# Altium schematic sheet RF-BIG-DB5AT_main_v1.schdoc
size OrCAD D; Organization: MAHLE International GmbH; Address1: Pragstr. 26 - 46; Address2: 70376 Stuttgart; Address3: Germany; DocumentNumber: 1; SheetNumber: 1; SheetTotal: 3
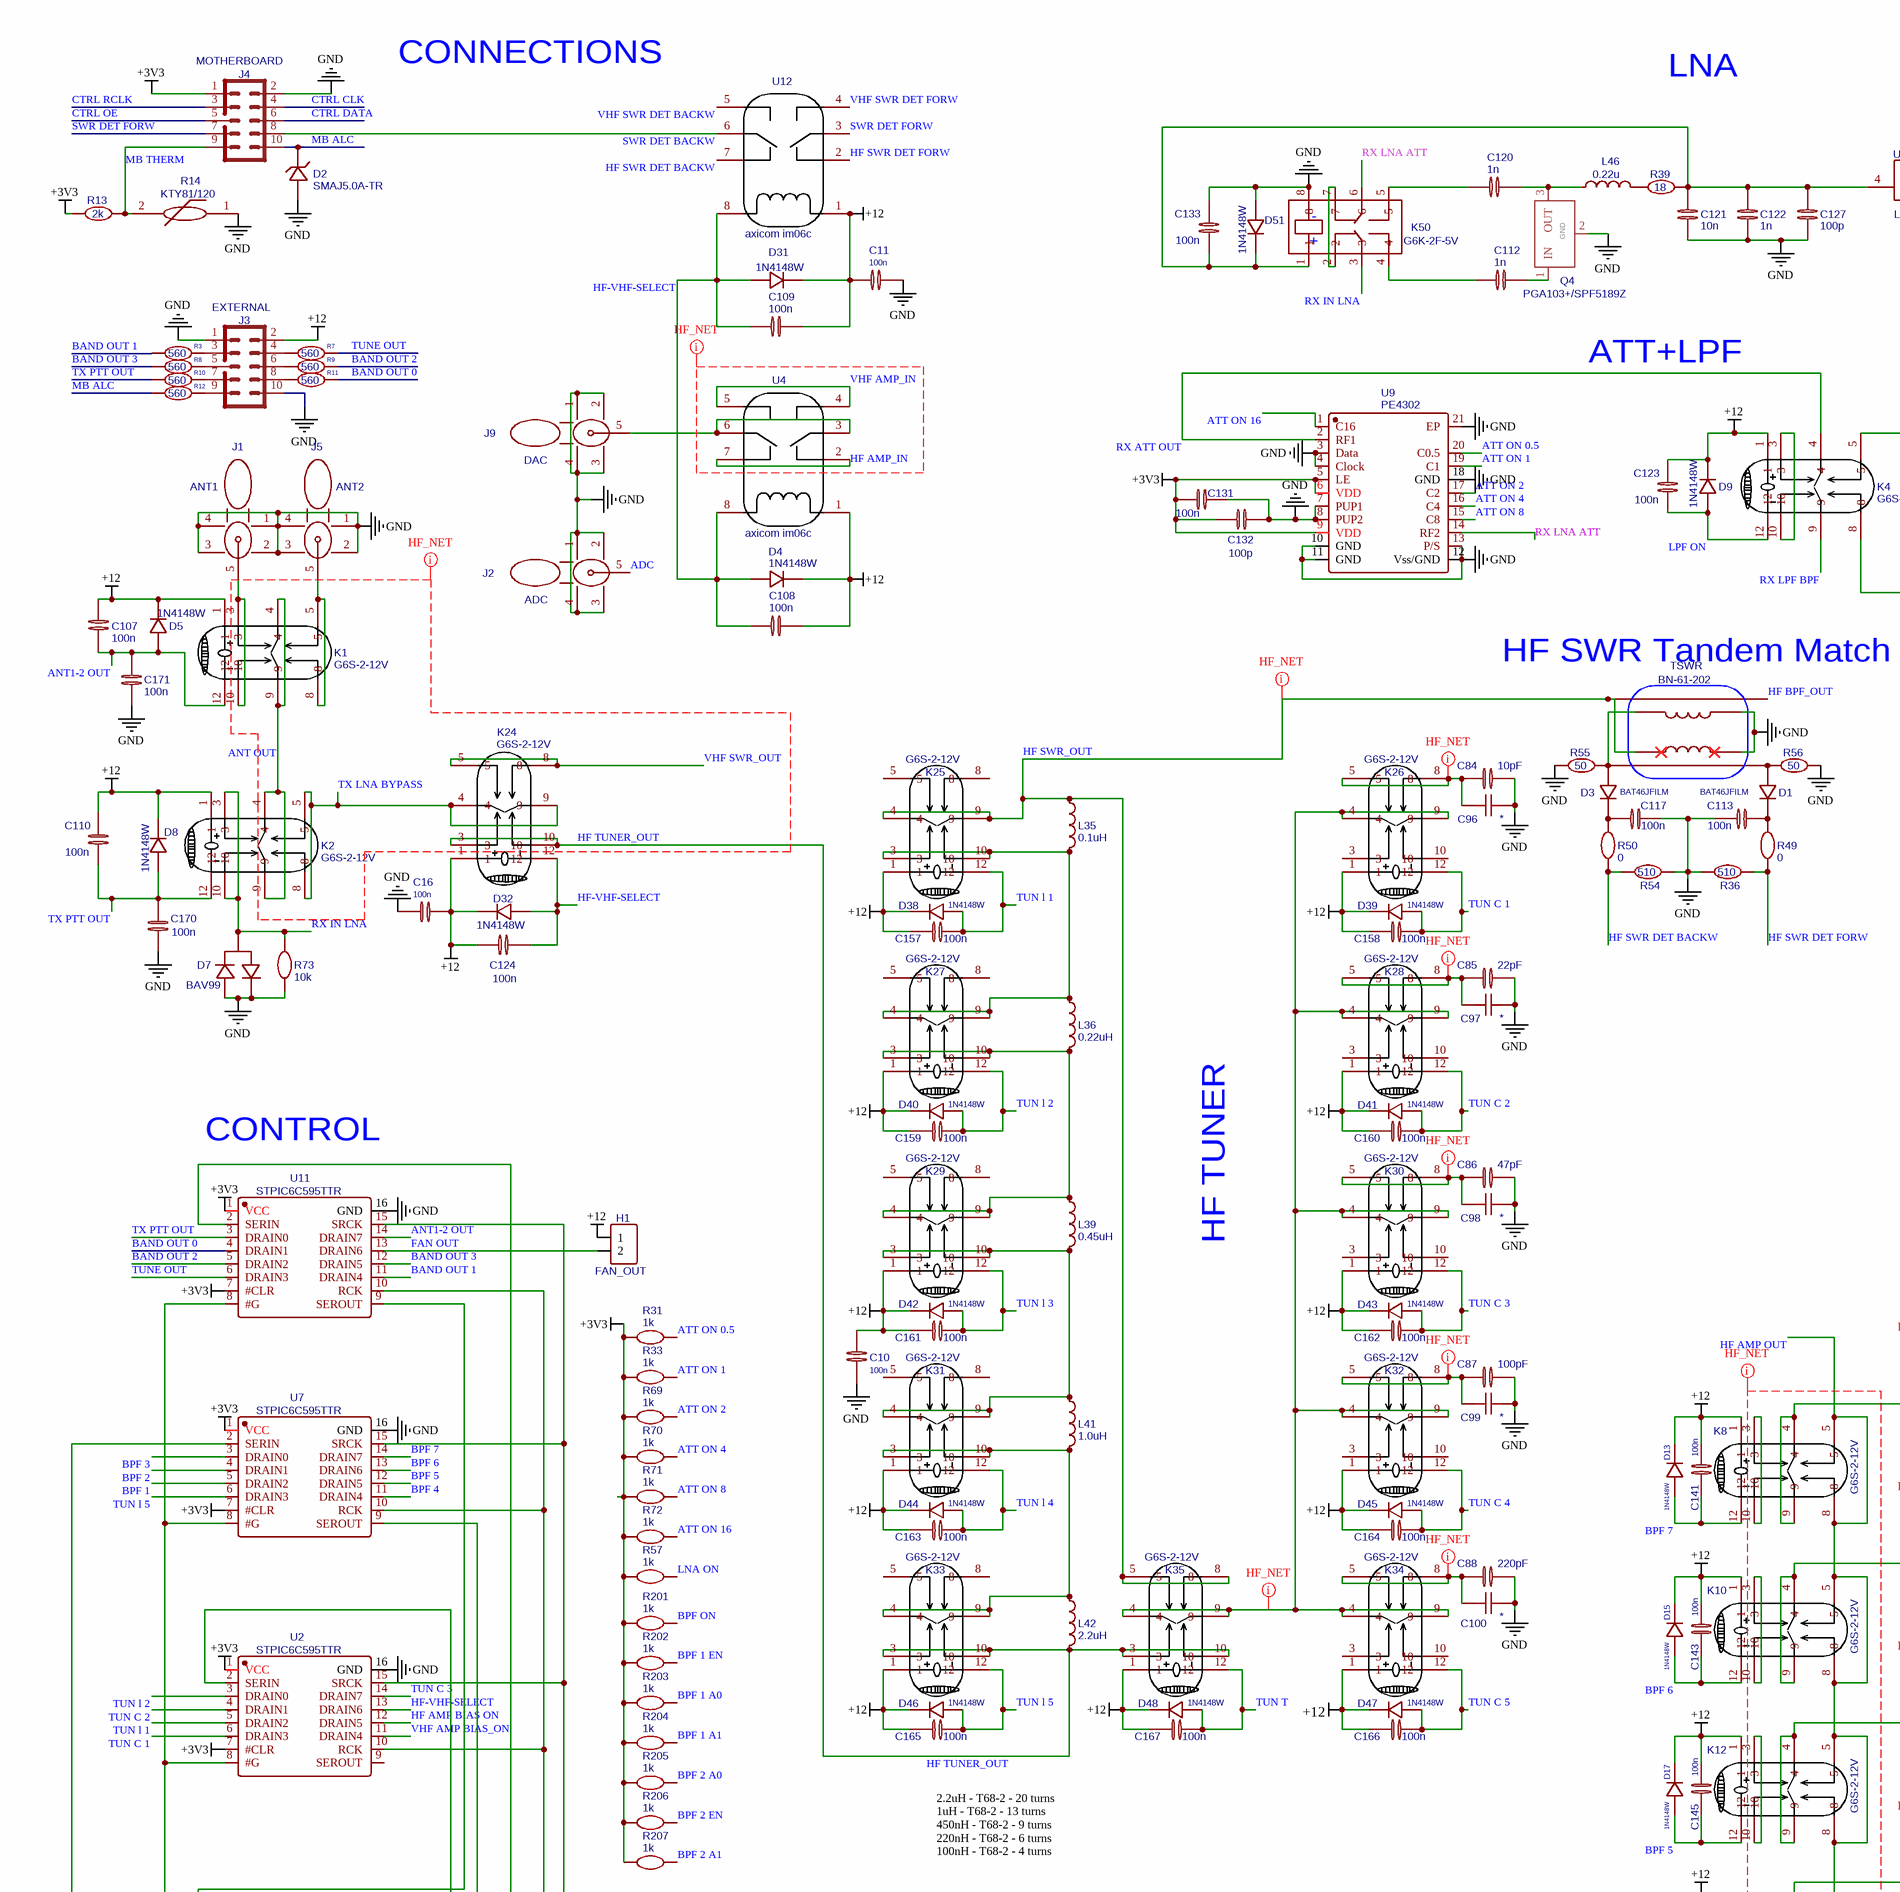
[diagram p0: RF-BIG-DB5AT_main_v1.schdoc, top left]
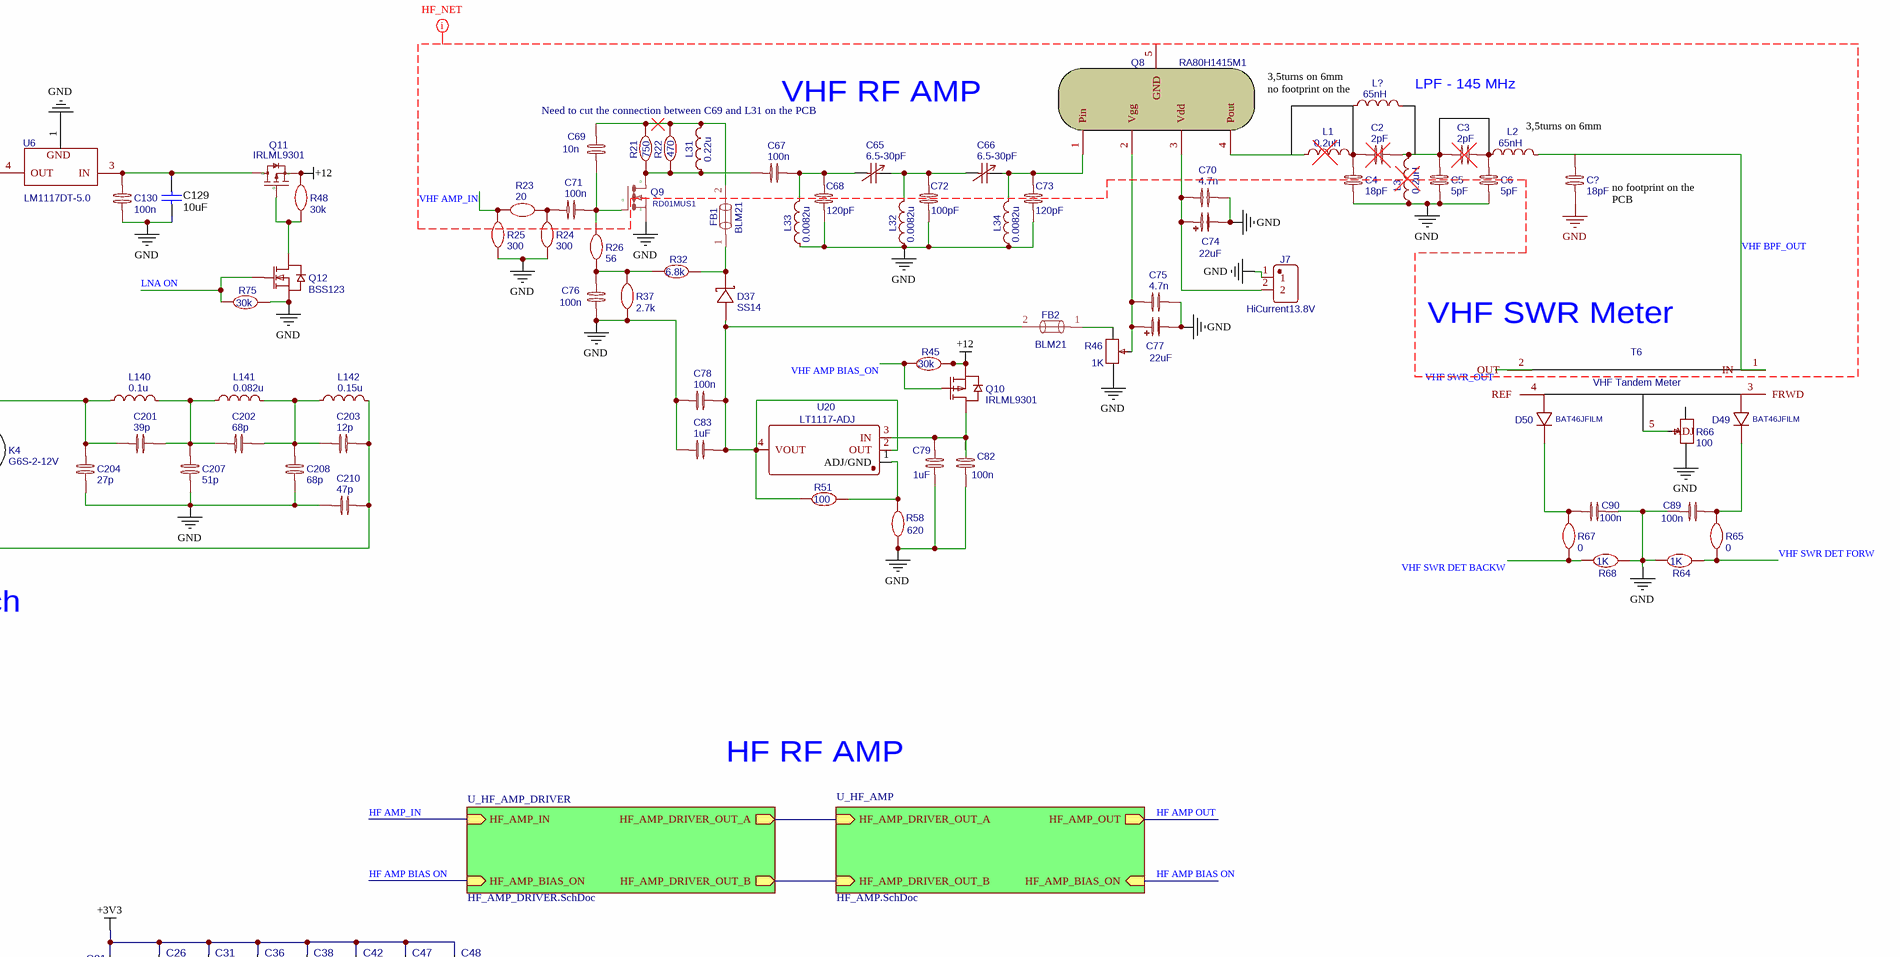
[diagram p1: RF-BIG-DB5AT_main_v1.schdoc, top right]
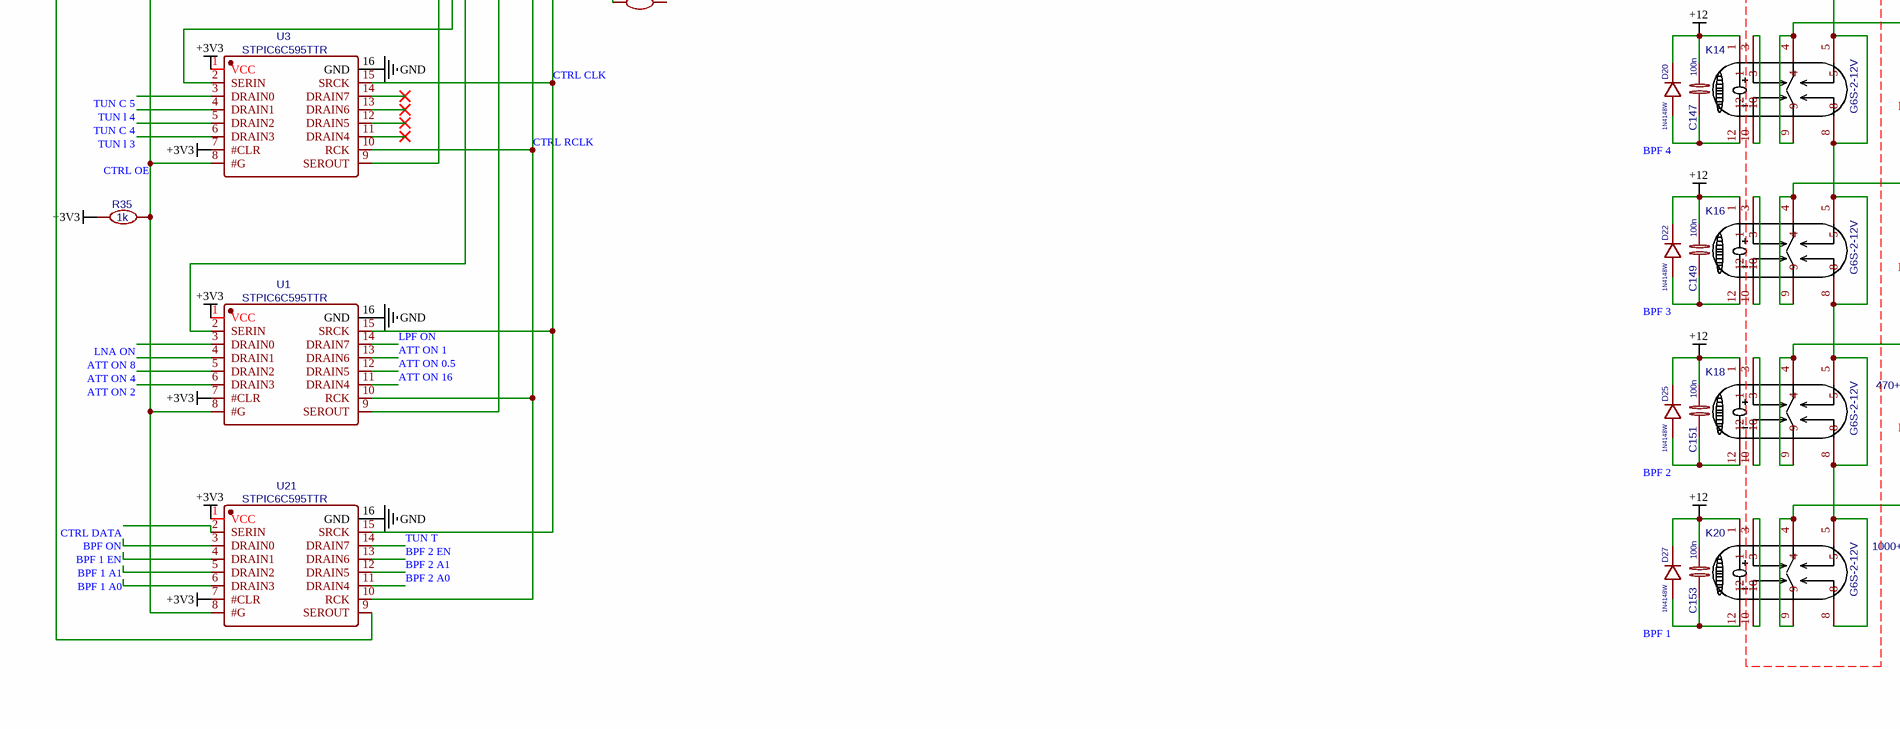
[diagram p2: RF-BIG-DB5AT_main_v1.schdoc, bottom left]
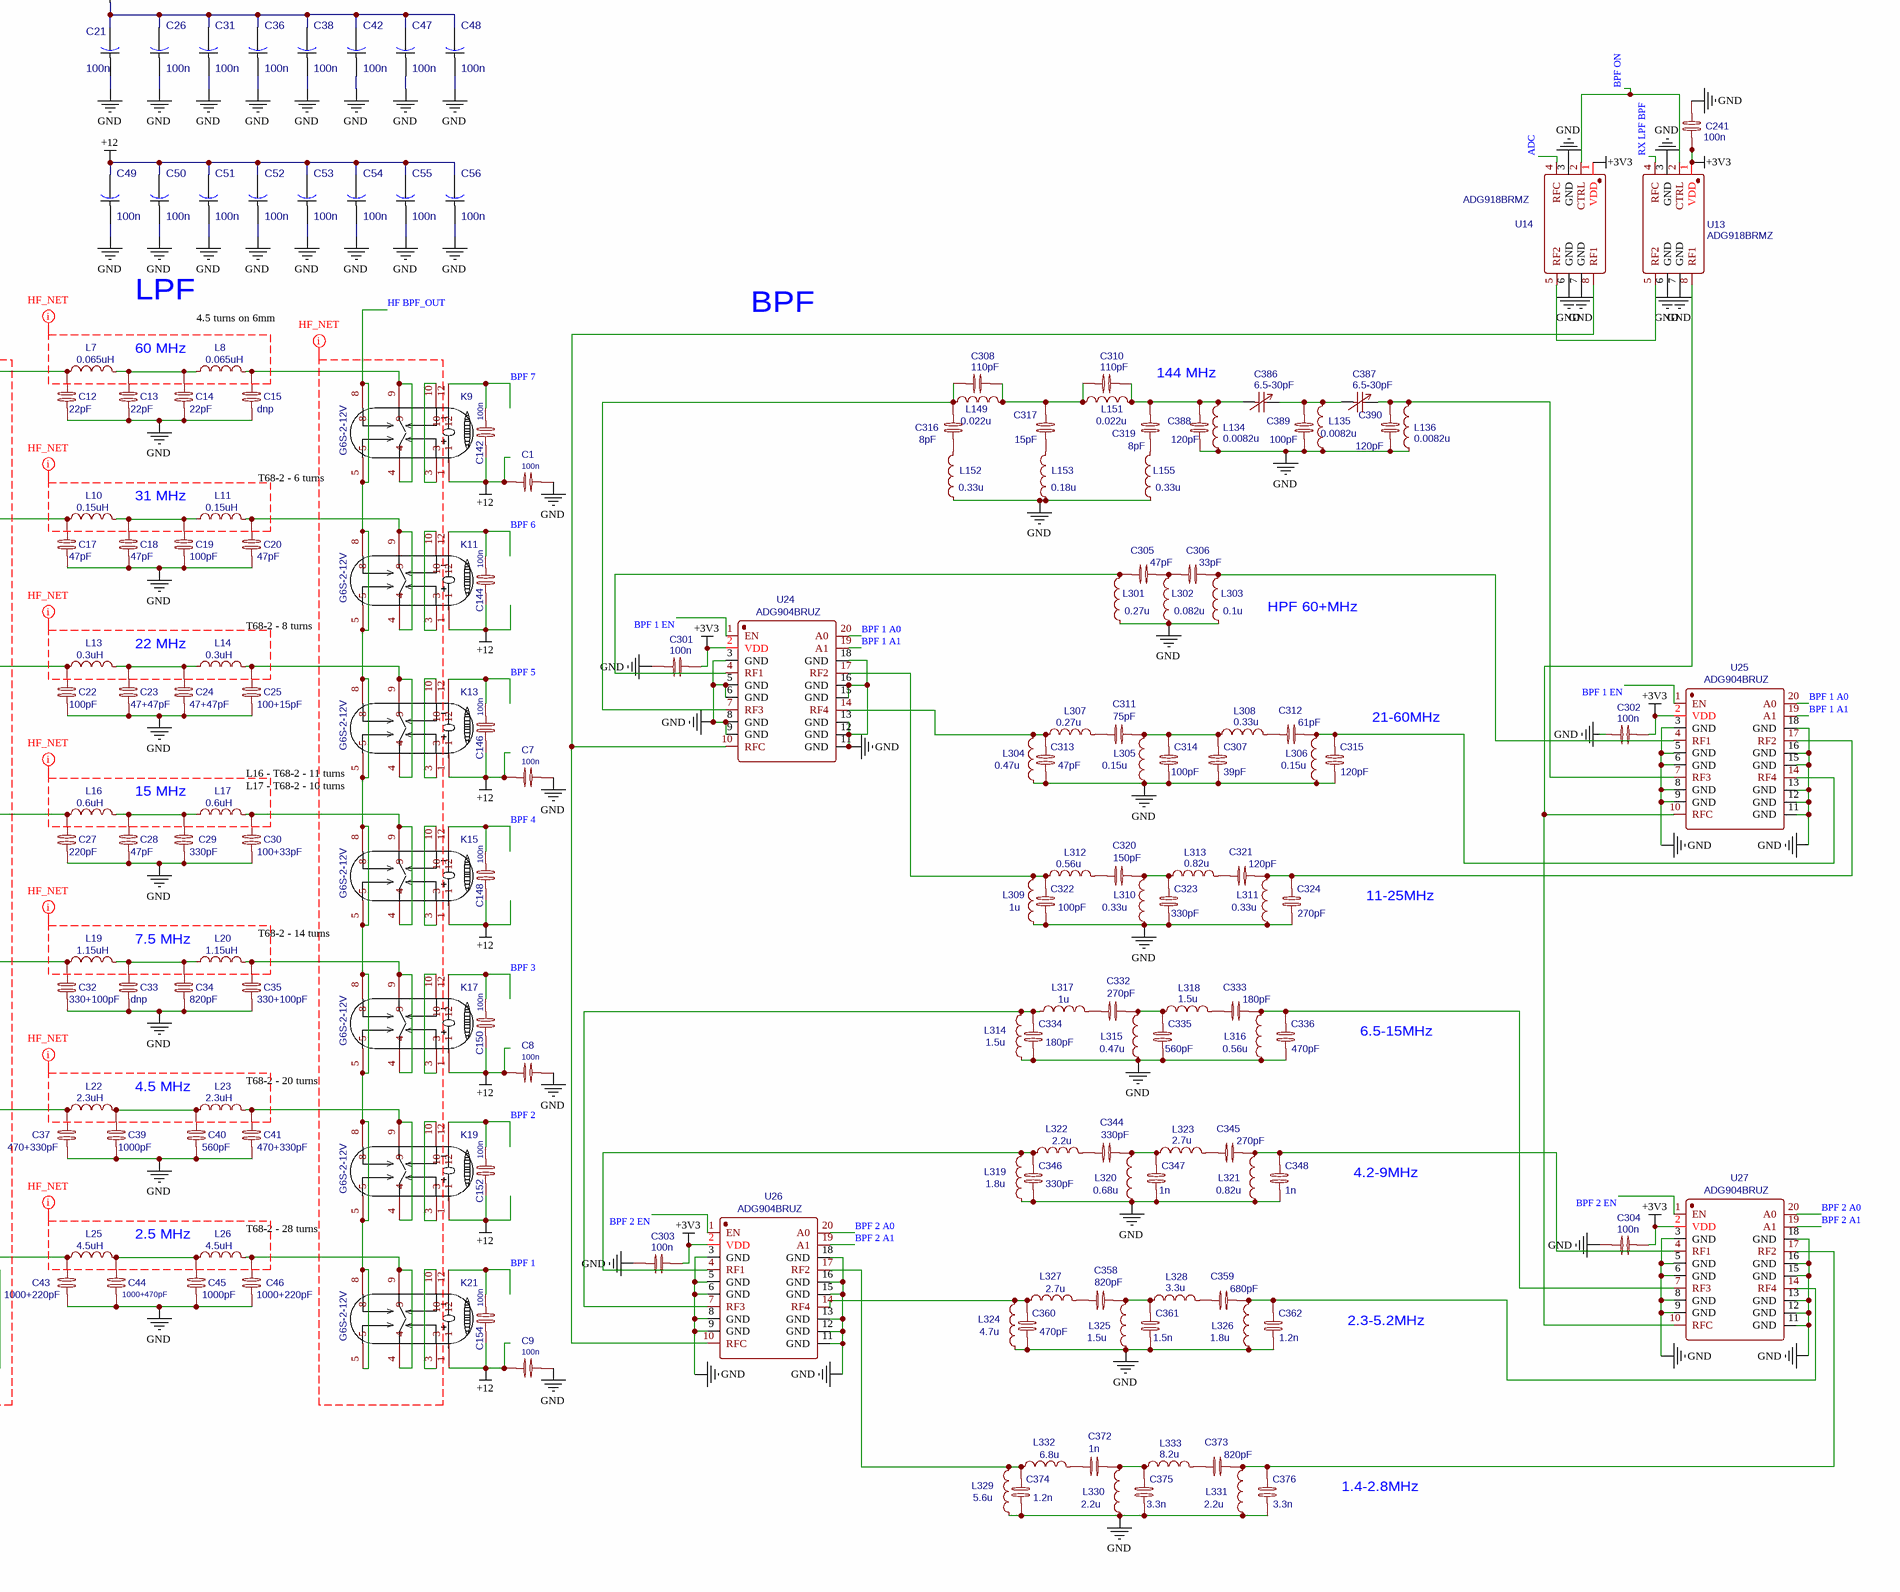
[diagram p3: RF-BIG-DB5AT_main_v1.schdoc, bottom right]

## Parts
C1  100n  [C0805]
C2  2pF  [C1206]
C3  2pF  [C1206]
C4  18pF  [C1206]
C5  5pF  [C1206]
C6  5pF  [C1206]
C7  100n  [C0805]
C8  100n  [C0805]
C9  100n  [C0805]
C10  100n  [C0805]
C11  100n  [C0805]
C12  22pF  [C1210]
C13  22pF  [C1210]
C14  22pF  [C1210]
C15  dnp  [C1210]
C16  100n  [C0805]
C17  47pF  [C1210]
C18  47pF  [C1210]
C19  100pF  [C1210]
C20  47pF  [C1210]
C21  100n  [CAP_0805]
C22  100pF  [C1210]
C23  47+47pF  [C1210]
C24  47+47pF  [C1210]
C25  100+15pF  [C1210]
C26  100n  [CAP_0805]
C27  220pF  [C1210]
C28  47pF  [C1210]
C29  330pF  [C1210]
C30  100+33pF  [C1210]
C31  100n  [CAP_0805]
C32  330+100pF  [C1210]
C33  dnp  [C1210]
C34  820pF  [C1210]
C35  330+100pF  [C1210]
C36  100n  [CAP_0805]
C37  470+330pF  [C1210]
C38  100n  [CAP_0805]
C39  1000pF  [C1210]
C40  560pF  [C1210]
C41  470+330pF  [C1210]
C42  100n  [CAP_0805]
C43  1000+220pF  [C1210]
C44  1000+470pF  [C1210]
C45  1000pF  [C1210]
C46  1000+220pF  [C1210]
C47  100n  [CAP_0805]
C48  100n  [CAP_0805]
C49  100n  [CAP_0805]
C50  100n  [CAP_0805]
C51  100n  [CAP_0805]
C52  100n  [CAP_0805]
C53  100n  [CAP_0805]
C54  100n  [CAP_0805]
C55  100n  [CAP_0805]
C56  100n  [CAP_0805]
C65  6.5-30pF  [CAP-ADJ-SMD_L4.5-W3.2-L]
C66  6.5-30pF  [CAP-ADJ-SMD_L4.5-W3.2-L]
C67  100n  [C0805]
C68  120pF  [C0805]
C69  10n  [C0805]
C70  4.7n  [C0805]
C71  100n  [C0805]
C72  100pF  [C0805]
C73  120pF  [C0805]
C74  22uF  [CASE-B_3528]
C75  4.7n  [C0805]
C76  100n  [C0805]
C77  22uF  [CASE-B_3528]
C78  100n  [C0805]
C79  1uF  [C0805]
C82  100n  [C0805]
C83  1uF  [C0805]
C84  10pF  [C1206]
C85  22pF  [C1206]
C86  47pF  [C1206]
C87  100pF  [C1206]
C88  220pF  [C1206]
C89  100n  [C0805]
C90  100n  [C0805]
C96  *  [CAP-TH_L8.0-W4.0-P7.50-D0.6]
C97  *  [CAP-TH_L8.0-W4.0-P7.50-D0.6]
C98  *  [CAP-TH_L8.0-W4.0-P7.50-D0.6]
C99  *  [CAP-TH_L8.0-W4.0-P7.50-D0.6]
C100  *  [CAP-TH_L8.0-W4.0-P7.50-D0.6]
C107  100n  [C0805]
C108  100n  [C0805]
C109  100n  [C0805]
C110  100n  [C0805]
C112  1n  [C0805]
C113  100n  [C0805]
C117  100n  [C0805]
C120  1n  [C0805]
C121  10n  [C0805]
C122  1n  [C0805]
C123  100n  [C0805]
C124  100n  [C0805]
C127  100p  [C0805]
C129  value 10uF  [1206_180]
C130  100n  [C0805]
C131  100n  [C0805]
C132  100p  [C0805]
C133  100n  [C0805]
C141  100n  [C0805]
C142  100n  [C0805]
C143  100n  [C0805]
C144  100n  [C0805]
C145  100n  [C0805]
C146  100n  [C0805]
C147  100n  [C0805]
C148  100n  [C0805]
C149  100n  [C0805]
C150  100n  [C0805]
C151  100n  [C0805]
C152  100n  [C0805]
C153  100n  [C0805]
C154  100n  [C0805]
C157  100n  [C0805]
C158  100n  [C0805]
C159  100n  [C0805]
C160  100n  [C0805]
C161  100n  [C0805]
C162  100n  [C0805]
C163  100n  [C0805]
C164  100n  [C0805]
C165  100n  [C0805]
C166  100n  [C0805]
C167  100n  [C0805]
C170  100n  [C0805]
C171  100n  [C0805]
C201  39p  [C0805]
C202  68p  [C0805]
C203  12p  [C0805]
C204  27p  [C0805]
C207  51p  [C0805]
C208  68p  [C0805]
C210  47p  [C0805]
C241  100n  [C0805]
C301  100n  [C0805]
C302  100n  [C0805]
C303  100n  [C0805]
C304  100n  [C0805]
C305  47pF  [C0805]
C306  33pF  [C0805]
C307  39pF  [C0805]
C308  110pF  [C0805]
C310  110pF  [C0805]
C311  75pF  [C0805]
C312  61pF  [C0805]
C313  47pF  [C0805]
C314  100pF  [C0805]
C315  120pF  [C0805]
C316  8pF  [C0805]
C317  15pF  [C0805]
C319  8pF  [C0805]
C320  150pF  [C0805]
C321  120pF  [C0805]
C322  100pF  [C0805]
C323  330pF  [C0805]
C324  270pF  [C0805]
C332  270pF  [C0805]
C333  180pF  [C0805]
C334  180pF  [C0805]
C335  560pF  [C0805]
C336  470pF  [C0805]
C344  330pF  [C0805]
C345  270pF  [C0805]
C346  330pF  [C0805]
C347  1n  [C0805]
C348  1n  [C0805]
C358  820pF  [C0805]
C359  680pF  [C0805]
C360  470pF  [C0805]
C361  1.5n  [C0805]
C362  1.2n  [C0805]
C372  1n  [C0805]
C373  820pF  [C0805]
C374  1.2n  [C0805]
C375  3.3n  [C0805]
C376  3.3n  [C0805]
C386  6.5-30pF  [CAP-ADJ-SMD_L4.5-W3.2-L]
C387  6.5-30pF  [CAP-ADJ-SMD_L4.5-W3.2-L]
C388  120pF  [C0805]
C389  100pF  [C0805]
C390  120pF  [C0805]
C?  18pF  [C1206]
D1  BAT46JFILM  [SOD-323_L1.8-W1.3-LS2.5-RD]
D2  SMAJ5.0A-TR  [SMA_L4.3-W2.6-LS5.2-RD]
D3  BAT46JFILM  [SOD-323_L1.8-W1.3-LS2.5-RD]
D4  1N4148W  [SOD-123FL_L2.6-W1.6-LS3.4-RD]
D5  1N4148W  [SOD-123FL_L2.6-W1.6-LS3.4-RD]
D7  BAV99  [SOT-23-3_L2.9-W1.3-P1.90-LS2.4-BR]
D8  1N4148W  [SOD-123FL_L2.6-W1.6-LS3.4-RD]
D9  1N4148W  [SOD-123FL_L2.6-W1.6-LS3.4-RD]
D13  1N4148W  [SOD-123FL_L2.6-W1.6-LS3.4-RD]
D15  1N4148W  [SOD-123FL_L2.6-W1.6-LS3.4-RD]
D17  1N4148W  [SOD-123FL_L2.6-W1.6-LS3.4-RD]
D20  1N4148W  [SOD-123FL_L2.6-W1.6-LS3.4-RD]
D22  1N4148W  [SOD-123FL_L2.6-W1.6-LS3.4-RD]
D25  1N4148W  [SOD-123FL_L2.6-W1.6-LS3.4-RD]
D27  1N4148W  [SOD-123FL_L2.6-W1.6-LS3.4-RD]
D31  1N4148W  [SOD-123FL_L2.6-W1.6-LS3.4-RD]
D32  1N4148W  [SOD-123FL_L2.6-W1.6-LS3.4-RD]
D37  SS14  [SMA_L4.4-W2.8-LS5.4-RD]
D38  1N4148W  [SOD-123FL_L2.6-W1.6-LS3.4-RD]
D39  1N4148W  [SOD-123FL_L2.6-W1.6-LS3.4-RD]
D40  1N4148W  [SOD-123FL_L2.6-W1.6-LS3.4-RD]
D41  1N4148W  [SOD-123FL_L2.6-W1.6-LS3.4-RD]
D42  1N4148W  [SOD-123FL_L2.6-W1.6-LS3.4-RD]
D43  1N4148W  [SOD-123FL_L2.6-W1.6-LS3.4-RD]
D44  1N4148W  [SOD-123FL_L2.6-W1.6-LS3.4-RD]
D45  1N4148W  [SOD-123FL_L2.6-W1.6-LS3.4-RD]
D46  1N4148W  [SOD-123FL_L2.6-W1.6-LS3.4-RD]
D47  1N4148W  [SOD-123FL_L2.6-W1.6-LS3.4-RD]
D48  1N4148W  [SOD-123FL_L2.6-W1.6-LS3.4-RD]
D49  BAT46JFILM  [SOD-323_L1.8-W1.3-LS2.5-RD]
D50  BAT46JFILM  [SOD-323_L1.8-W1.3-LS2.5-RD]
D51  1N4148W  [SOD-123FL_L2.6-W1.6-LS3.4-RD]
FB1  BLM21  [FERRITE_BEAD]
FB2  BLM21  [FERRITE_BEAD]
H1  FAN_OUT  [HDR-F-2.54_1X2]
J1  ANT1  [SMA-TH_BWSMA-KE-Z001]
J2  ADC  [SMA-TH_BWSMA-KE-Z001]
J3  EXTERNAL  [IDC-10]
J4  MOTHERBOARD  [IDC-10]
J5  ANT2  [SMA-TH_BWSMA-KE-Z001]
J7  HiCurrent13.8V  [CONN-TH_TY500-5.08-02P-14-00AH]
J9  DAC  [SMA-TH_BWSMA-KE-Z001]
K1  G6S-2-12V  [RELAY-TH_G6S-2-X]
K2  G6S-2-12V  [RELAY-TH_G6S-2-X]
K4  G6S-2-12V  [RELAY-TH_G6S-2-X]
K8  G6S-2-12V  [RELAY-TH_G6S-2-X]
K9  G6S-2-12V  [RELAY-TH_G6S-2-X]
K10  G6S-2-12V  [RELAY-TH_G6S-2-X]
K11  G6S-2-12V  [RELAY-TH_G6S-2-X]
K12  G6S-2-12V  [RELAY-TH_G6S-2-X]
K13  G6S-2-12V  [RELAY-TH_G6S-2-X]
K14  G6S-2-12V  [RELAY-TH_G6S-2-X]
K15  G6S-2-12V  [RELAY-TH_G6S-2-X]
K16  G6S-2-12V  [RELAY-TH_G6S-2-X]
K17  G6S-2-12V  [RELAY-TH_G6S-2-X]
K18  G6S-2-12V  [RELAY-TH_G6S-2-X]
K19  G6S-2-12V  [RELAY-TH_G6S-2-X]
K20  G6S-2-12V  [RELAY-TH_G6S-2-X]
K21  G6S-2-12V  [RELAY-TH_G6S-2-X]
K24  G6S-2-12V  [RELAY-TH_G6S-2-X]
K25  G6S-2-12V  [RELAY-TH_G6S-2-X]
K26  G6S-2-12V  [RELAY-TH_G6S-2-X]
K27  G6S-2-12V  [RELAY-TH_G6S-2-X]
K28  G6S-2-12V  [RELAY-TH_G6S-2-X]
K29  G6S-2-12V  [RELAY-TH_G6S-2-X]
K30  G6S-2-12V  [RELAY-TH_G6S-2-X]
K31  G6S-2-12V  [RELAY-TH_G6S-2-X]
K32  G6S-2-12V  [RELAY-TH_G6S-2-X]
K33  G6S-2-12V  [RELAY-TH_G6S-2-X]
K34  G6S-2-12V  [RELAY-TH_G6S-2-X]
K35  G6S-2-12V  [RELAY-TH_G6S-2-X]
K50  G6K-2F-5V  [RELAY-TH_G6K-2F-Y]
L1  0.2uH  [BEAD-TH_BD3.5-L4.7-P8.70-D0.7]
L2  65nH  [BEAD-TH_BD3.5-L4.7-P8.70-D0.7]
L3  0.2uH  [BEAD-TH_BD3.5-L4.7-P8.70-D0.7]
L7  0.065uH  [BEAD-TH_BD3.5-L4.7-P8.70-D0.7]
L8  0.065uH  [BEAD-TH_BD3.5-L4.7-P8.70-D0.7]
L10  0.15uH  [BEAD-TH_BD3.5-L4.7-P8.70-D0.7]
L11  0.15uH  [BEAD-TH_BD3.5-L4.7-P8.70-D0.7]
L13  0.3uH  [BEAD-TH_BD3.5-L4.7-P8.70-D0.7]
L14  0.3uH  [BEAD-TH_BD3.5-L4.7-P8.70-D0.7]
L16  0.6uH  [BEAD-TH_BD3.5-L4.7-P8.70-D0.7]
L17  0.6uH  [BEAD-TH_BD3.5-L4.7-P8.70-D0.7]
L19  1.15uH  [BEAD-TH_BD3.5-L4.7-P8.70-D0.7]
L20  1.15uH  [BEAD-TH_BD3.5-L4.7-P8.70-D0.7]
L22  2.3uH  [BEAD-TH_BD3.5-L4.7-P8.70-D0.7]
L23  2.3uH  [BEAD-TH_BD3.5-L4.7-P8.70-D0.7]
L25  4.5uH  [BEAD-TH_BD3.5-L4.7-P8.70-D0.7]
L26  4.5uH  [BEAD-TH_BD3.5-L4.7-P8.70-D0.7]
L31  0.22u  [L1206]
L32  0.0082u  [L0805]
L33  0.0082u  [L0805]
L34  0.0082u  [L0805]
L35  0.1uH  [BEAD-TH_BD3.5-L4.7-P8.70-D0.7]
L36  0.22uH  [BEAD-TH_BD3.5-L4.7-P8.70-D0.7]
L39  0.45uH  [BEAD-TH_BD3.5-L4.7-P8.70-D0.7]
L41  1.0uH  [BEAD-TH_BD3.5-L4.7-P8.70-D0.7]
L42  2.2uH  [BEAD-TH_BD3.5-L4.7-P8.70-D0.7]
L46  0.22u  [L0805]
L134  0.0082u  [L0805-WOLF]
L135  0.0082u  [L0805-WOLF]
L136  0.0082u  [L0805-WOLF]
L140  0.1u  [L0805-WOLF]
L141  0.082u  [L0805-WOLF]
L142  0.15u  [L0805-WOLF]
L149  0.022u  [L0805-WOLF]
L151  0.022u  [L0805-WOLF]
L152  0.33u  [L0805-WOLF]
L153  0.18u  [L0805-WOLF]
L155  0.33u  [L0805-WOLF]
L301  0.27u  [L0805-WOLF]
L302  0.082u  [L0805-WOLF]
L303  0.1u  [L0805-WOLF]
L304  0.47u  [L0805-WOLF]
L305  0.15u  [L0805-WOLF]
L306  0.15u  [L0805-WOLF]
L307  0.27u  [L0805-WOLF]
L308  0.33u  [L0805-WOLF]
L309  1u  [L0805-WOLF]
L310  0.33u  [L0805-WOLF]
L311  0.33u  [L0805-WOLF]
L312  0.56u  [L0805-WOLF]
L313  0.82u  [L0805-WOLF]
L314  1.5u  [L0805-WOLF]
L315  0.47u  [L0805-WOLF]
L316  0.56u  [L0805-WOLF]
L317  1u  [L0805-WOLF]
L318  1.5u  [L0805-WOLF]
L319  1.8u  [L0805-WOLF]
L320  0.68u  [L0805-WOLF]
L321  0.82u  [L0805-WOLF]
L322  2.2u  [L0805-WOLF]
L323  2.7u  [L0805-WOLF]
L324  4.7u  [L0805-WOLF]
L325  1.5u  [L0805-WOLF]
L326  1.8u  [L0805-WOLF]
L327  2.7u  [L0805-WOLF]
L328  3.3u  [L0805-WOLF]
L329  5.6u  [L0805-WOLF]
L330  2.2u  [L0805-WOLF]
L331  2.2u  [L0805-WOLF]
L332  6.8u  [L0805-WOLF]
L333  8.2u  [L0805-WOLF]
L?  65nH  [BEAD-TH_BD3.5-L4.7-P8.70-D0.7]
Q4  PGA103+/SPF5189Z  [SOT-89-3_L4.5-W2.5-P1.50-LS4.2-TL]
Q8  RA80H1415M1  [RA80H1415M1]
Q9  RD01MUS1  [RD01MUS1]
Q10  IRLML9301  [SOT-23-3_L2.9-W1.3-P1.90-LS2.4-BR]
Q11  IRLML9301  [SOT-23_L2.9-W1.3-P1.90-LS2.4-BR]
Q12  BSS123  [SOT-23-3_L2.9-W1.6-P1.90-LS2.8-BR]
R3  560  [R0805]
R7  560  [R0805]
R8  560  [R0805]
R9  560  [R0805]
R10  560  [R0805]
R11  560  [R0805]
R12  560  [R0805]
R13  2k  [R0805]
R14  KTY81/120  [RES-TH_KTY81]
R21  750  [R0805]
R22  470  [R0805]
R23  20  [R0805]
R24  300  [R0805]
R25  300  [R0805]
R26  56  [R0805]
R31  1k  [R0805]
R32  6.8k  [R0805]
R33  1k  [R0805]
R35  1k  [R0805]
R36  510  [R1206]
R37  2.7k  [R0805]
R39  18  [R1206]
R45  30k  [R0805]
R46  1K  [RES-ADJ-TH_3296W]
R48  30k  [R0805]
R49  0  [R1206]
R50  0  [R1206]
R51  100  [R0805]
R54  510  [R1206]
R55  50  [R1206]
R56  50  [R1206]
R57  1k  [R0805]
R58  620  [R0805]
R64  1K  [R1206]
R65  0  [R1206]
R66  100  [RES-ADJ-TH_3362P]
R67  0  [R1206]
R68  1K  [R1206]
R69  1k  [R0805]
R70  1k  [R0805]
R71  1k  [R0805]
R72  1k  [R0805]
R73  10k  [R1206]
R75  30k  [R0805]
R201  1k  [R0805]
R202  1k  [R0805]
R203  1k  [R0805]
R204  1k  [R0805]
R205  1k  [R0805]
R206  1k  [R0805]
R207  1k  [R0805]
T6  VHF Tandem Meter  [VHF SWR METER]
TSWR  BN-61-202  [BN43-202_TANDEM]
U1  STPIC6C595TTR  [TSSOP-16_L5.0-W4.4-P0.65-LS6.4-BL]
U2  STPIC6C595TTR  [TSSOP-16_L5.0-W4.4-P0.65-LS6.4-BL]
U3  STPIC6C595TTR  [TSSOP-16_L5.0-W4.4-P0.65-LS6.4-BL]
U4  axicom im06c  [IM06C]
U6  LM1117DT-5.0  [TD03B]
U7  STPIC6C595TTR  [TSSOP-16_L5.0-W4.4-P0.65-LS6.4-BL]
U9  PE4302  [QFN-20L_L4.0-W4.0-P0.50-BL-EP2.0]
U11  STPIC6C595TTR  [TSSOP-16_L5.0-W4.4-P0.65-LS6.4-BL]
U12  axicom im06c  [IM06C]
U13  ADG918BRMZ  [MSOP-8_L3.0-W3.0-P0.65-LS4.9-BL]
U14  ADG918BRMZ  [MSOP-8_L3.0-W3.0-P0.65-LS4.9-BL]
U20  LT1117-ADJ  [SOT-223-3_L6.5-W3.4-P2.30-LS7.0-BR]
U21  STPIC6C595TTR  [TSSOP-16_L5.0-W4.4-P0.65-LS6.4-BL]
U24  ADG904BRUZ  [TSSOP-20]
U25  ADG904BRUZ  [TSSOP-20]
U26  ADG904BRUZ  [TSSOP-20]
U27  ADG904BRUZ  [TSSOP-20]

## Sub-sheets
U_HF_AMP = HF_AMP.SchDoc: HF_AMP_OUT (out), HF_AMP_BIAS_ON (in), HF_AMP_DRIVER_OUT_A (in), HF_AMP_DRIVER_OUT_B (in)
U_HF_AMP_DRIVER = HF_AMP_DRIVER.SchDoc: HF_AMP_IN (in), HF_AMP_BIAS_ON (in), HF_AMP_DRIVER_OUT_A (out), HF_AMP_DRIVER_OUT_B (out)

## Nets
+3V3: C21.2 C26.2 C31.2 C36.2 C38.2 C42.2 C47.2 C48.2 C131.1 C132.1 C241.1 C301.1 C302.1 C303.1 C304.1 J4.1 R13.1 R31.1 R33.1 R35.1 R57.1 R69.1 R70.1 R71.1 R72.1 R201.1 R202.1 R203.1 R204.1 R205.1 R206.1 R207.1 U1.1(VCC) U1.7(#CLR) U2.1(VCC) U2.7(#CLR) U3.1(VCC) U3.7(#CLR) U7.1(VCC) U7.7(#CLR) U9.5(LE) U9.6(VDD) U9.9(VDD) U11.1(VCC) U11.7(#CLR) U13.1(VDD) U14.1(VDD) U21.1(VCC) U21.7(#CLR) U24.2(VDD) U25.2(VDD) U26.2(VDD) U27.2(VDD)
+12: C1.1 C7.1 C8.1 C9.1 C10.1 C11.1 C16.1 C49.2 C50.2 C51.2 C52.2 C53.2 C54.2 C55.2 C56.2 C107.1 C108.2 C109.2 C110.2 C123.2 C124.1 C141.1 C142.2 C143.1 C144.2 C145.1 C146.2 C147.1 C148.2 C149.1 C150.2 C151.1 C152.2 C153.1 C154.2 C157.2 C158.2 C159.2 C160.2 C161.2 C162.2 C163.2 C164.2 C165.2 C166.2 C167.2 D4.1 D5.1 D8.1 D9.1 D13.1 D15.1 D17.1 D20.1 D22.1 D25.1 D27.1 D31.1 D32.1 D38.1 D39.1 D40.1 D41.1 D42.1 D43.1 D44.1 D45.1 D46.1 D47.1 D48.1 H1.1 J3.2 K1.1 K2.1 K4.1 K8.1 K9.1 K10.1 K11.1 K12.1 K13.1 K14.1 K15.1 K16.1 K17.1 K18.1 K19.1 K20.1 K21.1 K24.1 K25.1 K26.1 K27.1 K28.1 K29.1 K30.1 K31.1 K32.1 K33.1 K34.1 K35.1 Q10.2(S) Q11.2(S) R45.1 R48.2 U4.1 U12.1
GND: C1.2 C4.1 C5.1 C6.1 C7.2 C8.2 C9.2 C10.2 C11.2 C12.1 C13.1 C14.1 C15.1 C16.2 C17.1 C18.1 C19.1 C20.1 C21.1 C22.1 C23.1 C24.1 C25.1 C26.1 C27.1 C28.1 C29.1 C30.1 C31.1 C32.1 C33.1 C34.1 C35.1 C36.1 C37.1 C38.1 C39.1 C40.1 C41.1 C42.1 C43.1 C44.1 C45.1 C46.1 C47.1 C48.1 C49.1 C50.1 C51.1 C52.1 C53.1 C54.1 C55.1 C56.1 C68.1 C70.2 C72.1 C73.1 C74.2 C75.2 C76.1 C77.2 C78.1 C79.1 C82.1 C83.1 C84.2 C85.2 C86.2 C87.2 C88.2 C89.2 C90.1 C96.2 C97.2 C98.2 C99.2 C100.2 C113.2 C117.1 C121.1 C122.1 C127.1 C129.1 C130.1 C131.2 C132.2 C133.2 C170.1 C171.1 C204.1 C207.1 C208.1 C210.2 C241.2 C301.2 C302.2 C303.2 C304.2 C307.1 C313.1 C314.1 C315.1 C322.1 C323.1 C324.1 C334.1 C335.1 C336.1 C346.1 C347.1 C348.1 C360.1 C361.1 C362.1 C374.1 C375.1 C376.1 C388.1 C389.1 C390.1 C?.1 D2.2(A) D7.1(A) D7.2(K) D51.2 J1.1 J1.2 J1.3 J1.4 J2.1 J2.2 J2.3 J2.4 J3.1 J3.10 J4.2 J5.1 J5.2 J5.3 J5.4 J7.1 J9.1 J9.2 J9.3 J9.4 K50.8 L3.1 L32.1 L33.1 L34.1 L134.1 L135.1 L136.1 L152.1 L153.1 L155.1 L301.1 L302.1 L303.1 L304.1 L305.1 L306.1 L309.1 L310.1 L311.1 L314.1 L315.1 L316.1 L319.1 L320.1 L321.1 L324.1 L325.1 L326.1 L329.1 L330.1 L331.1 Q4.2(GND) Q9.S Q12.2(S) R14.1 R24.1 R25.1 R36.1 R37.1 R46.1 R54.2 R55.1 R56.2 R58.2 R64.1 R66.3 R68.2 R73.1 R75.2 TSWR.7 U1.16(GND) U2.16(GND) U3.16(GND) U6.1(GND) U7.16(GND) U9.3(Data) U9.4(Clock) U9.7(PUP1) U9.8(PUP2) U9.10(GND) U9.11(GND) U9.12(Vss/GND) U9.13(P/S) U9.18(GND) U9.21(EP) U11.16(GND) U13.3(GND) U13.6(GND) U13.7(GND) U14.3(GND) U14.6(GND) U14.7(GND) U21.16(GND) U24.3(GND) U24.5(GND) U24.6(GND) U24.8(GND) U24.9(GND) U24.11(GND) U24.12(GND) U24.13(GND) U24.15(GND) U24.16(GND) U24.18(GND) U25.3(GND) U25.5(GND) U25.6(GND) U25.8(GND) U25.9(GND) U25.11(GND) U25.12(GND) U25.13(GND) U25.15(GND) U25.16(GND) U25.18(GND) U26.3(GND) U26.5(GND) U26.6(GND) U26.8(GND) U26.9(GND) U26.11(GND) U26.12(GND) U26.13(GND) U26.15(GND) U26.16(GND) U26.18(GND) U27.3(GND) U27.5(GND) U27.6(GND) U27.8(GND) U27.9(GND) U27.11(GND) U27.12(GND) U27.13(GND) U27.15(GND) U27.16(GND) U27.18(GND)
ADC: J2.5 U14.4(RFC)
ANT1-2 OUT: C107.2 C171.2 D5.2 K1.12 U11.14(DRAIN7)
ANT OUT: K1.4 K1.9 K2.4 K2.9
ATT ON 0.5: R31.2 U1.12(DRAIN5) U9.20(C0.5)
ATT ON 1: R33.2 U1.13(DRAIN6) U9.19(C1)
ATT ON 2: R69.2 U1.6(DRAIN3) U9.17(C2)
ATT ON 4: R70.2 U1.5(DRAIN2) U9.16(C4)
ATT ON 8: R71.2 U1.4(DRAIN1) U9.15(C8)
ATT ON 16: R72.2 U1.11(DRAIN4) U9.1(C16)
BAND OUT 0: R11.2 U11.4(DRAIN1)
BAND OUT 1: R3.1 U11.11(DRAIN4)
BAND OUT 2: R9.2 U11.5(DRAIN2)
BAND OUT 3: R8.1 U11.12(DRAIN5)
BPF 1: C153.2 C154.1 D27.2 K20.12 K21.12 U7.5(DRAIN2)
BPF 1 A0: R203.2 U21.6(DRAIN3) U24.20(A0) U25.20(A0)
BPF 1 A1: R204.2 U21.5(DRAIN2) U24.19(A1) U25.19(A1)
BPF 1 EN: R202.2 U21.4(DRAIN1) U24.1(EN) U25.1(EN)
BPF 2: C151.2 C152.1 D25.2 K18.12 K19.12 U7.4(DRAIN1)
BPF 2 A0: R205.2 U21.11(DRAIN4) U26.20(A0) U27.20(A0)
BPF 2 A1: R207.2 U21.12(DRAIN5) U26.19(A1) U27.19(A1)
BPF 2 EN: R206.2 U21.13(DRAIN6) U26.1(EN) U27.1(EN)
BPF 3: C149.2 C150.1 D22.2 K16.12 K17.12 U7.3(DRAIN0)
BPF 4: C147.2 C148.1 D20.2 K14.12 K15.12 U7.11(DRAIN4)
BPF 5: C145.2 C146.1 D17.2 K12.12 K13.12 U7.12(DRAIN5)
BPF 6: C143.2 C144.1 D15.2 K10.12 K11.12 U7.13(DRAIN6)
BPF 7: C141.2 C142.1 D13.2 K8.12 K9.12 U7.14(DRAIN7)
BPF ON: R201.2 U13.2(CTRL) U14.2(CTRL) U21.3(DRAIN0)
CTRL CLK: J4.4 U1.15(SRCK) U2.15(SRCK) U3.15(SRCK) U7.15(SRCK) U11.15(SRCK) U21.15(SRCK)
CTRL DATA: J4.6 U21.2(SERIN)
CTRL OE: J4.5 R35.2 U1.8(#G) U2.8(#G) U3.8(#G) U7.8(#G) U11.8(#G) U21.8(#G)
CTRL RCLK: J4.3 U1.10(RCK) U2.10(RCK) U3.10(RCK) U7.10(RCK) U11.10(RCK) U21.10(RCK)
FAN OUT: H1.2 U11.13(DRAIN6)
HF AMP BIAS ON: U2.12(DRAIN5) ; sheet U_HF_AMP_DRIVER/HF_AMP_BIAS_ON, sheet U_HF_AMP/HF_AMP_BIAS_ON
HF AMP OUT: K8.5 K8.8 K10.5 K10.8 K12.5 K12.8 K14.5 K14.8 K16.5 K16.8 K18.5 K18.8 K20.5 K20.8 ; sheet U_HF_AMP/HF_AMP_OUT
HF AMP_IN: U4.2 U4.7 ; sheet U_HF_AMP_DRIVER/HF_AMP_IN
HF BPF_OUT: K9.5 K9.8 K11.5 K11.8 K13.5 K13.8 K15.5 K15.8 K17.5 K17.8 K19.5 K19.8 K21.5 K21.8 TSWR.3
HF SWR DET BACKW: R50.1 R54.1 U12.7
HF SWR DET FORW: R36.2 R49.1 U12.2
HF SWR_OUT: K25.4 K25.9 K35.5 K35.8 L35.1 TSWR.4 TSWR.5
HF TUNER_OUT: K24.3 K24.10 K33.3 K33.10 K35.3 K35.10 L42.2
HF-VHF-SELECT: C108.1 C109.1 C124.2 D4.2 D31.2 D32.2 K24.12 U2.13(DRAIN6) U4.8 U12.8
LNA ON: Q12.1(G) R57.2 R75.1 U1.3(DRAIN0)
LPF ON: C123.1 D9.2 K4.12 U1.14(DRAIN7)
MB ALC: D2.1(C) J4.10 R12.1
MB THERM: J4.9 R13.2 R14.2
RX ATT OUT: K4.4 U9.2(RF1)
RX IN LNA: D7.3(K) K2.3 K2.10 K50.3 R73.2
RX LNA ATT: K50.6 U9.14(RF2)
RX LPF BPF: K4.9 U13.4(RFC)
SWR DET BACKW: J4.8 U12.6
SWR DET FORW: J4.7 U12.3
TUN C 1: C158.1 D39.2 K26.12 U2.6(DRAIN3)
TUN C 2: C160.1 D41.2 K28.12 U2.4(DRAIN1)
TUN C 3: C162.1 D43.2 K30.12 U2.14(DRAIN7)
TUN C 4: C164.1 D45.2 K32.12 U3.5(DRAIN2)
TUN C 5: C166.1 D47.2 K34.12 U3.3(DRAIN0)
TUN l 1: C157.1 D38.2 K25.12 U2.5(DRAIN2)
TUN l 2: C159.1 D40.2 K27.12 U2.3(DRAIN0)
TUN l 3: C161.1 D42.2 K29.12 U3.6(DRAIN3)
TUN l 4: C163.1 D44.2 K31.12 U3.4(DRAIN1)
TUN l 5: C165.1 D46.2 K33.12 U7.6(DRAIN3)
TUN T: C167.1 D48.2 K35.12 U21.14(DRAIN7)
TUNE OUT: R7.2 U11.6(DRAIN3)
TX LNA BYPASS: K2.5 K2.8 K24.4 K24.9
TX PTT OUT: C110.1 C170.2 D8.2 K2.12 R10.1 U11.3(DRAIN0)
VHF AMP BIAS_ON: Q10.1(G) R45.2 U2.11(DRAIN4)
VHF AMP_IN: R23.2 R25.2 U4.4 U4.5
VHF BPF_OUT: C?.2 L2.2 T6.1(IN)
VHF SWR DET BACKW: R67.1 R68.1 U12.5
VHF SWR DET FORW: R64.2 R65.1 U12.4
VHF SWR_OUT: K24.5 K24.8 T6.2(OUT)
NetC2_1: C2.1 C3.2 C5.2 L3.2
NetC2_2: C2.2 C4.2 L1.2
NetC3_1: C3.1 C6.2 L2.1
NetC12_2: C12.2 K8.4 K8.9 L7.1
NetC13_2: C13.2 C14.2 L7.2 L8.1
NetC15_2: C15.2 K9.4 K9.9 L8.2
NetC17_2: C17.2 K10.4 K10.9 L10.1
NetC18_2: C18.2 C19.2 L10.2 L11.1
NetC20_2: C20.2 K11.4 K11.9 L11.2
NetC22_2: C22.2 K12.4 K12.9 L13.1
NetC23_2: C23.2 C24.2 L13.2 L14.1
NetC25_2: C25.2 K13.4 K13.9 L14.2
NetC27_2: C27.2 K14.4 K14.9 L16.1
NetC28_2: C28.2 C29.2 L16.2 L17.1
NetC30_2: C30.2 K15.4 K15.9 L17.2
NetC32_2: C32.2 K16.4 K16.9 L19.1
NetC33_2: C33.2 C34.2 L19.2 L20.1
NetC35_2: C35.2 K17.4 K17.9 L20.2
NetC37_2: C37.2 K18.4 K18.9 L22.1
NetC39_2: C39.2 C40.2 L22.2 L23.1
NetC41_2: C41.2 K19.4 K19.9 L23.2
NetC43_2: C43.2 K20.4 K20.9 L25.1
NetC44_2: C44.2 C45.2 L25.2 L26.1
NetC46_2: C46.2 K21.4 K21.9 L26.2
NetC65_1: C65.1 C67.2 C68.2 L33.2
NetC65_2: C65.2 C66.1 C72.2 L32.2
NetC66_2: C66.2 C73.2 L34.2 Q8.1(Pin)
NetC67_1: C67.1 L31.1 Q9.D R21.1 R22.1
NetC69_1: C69.1 C71.2 Q9.G R26.2
NetC69_2: C69.2 FB1.2 L31.2 R21.2 R22.2
NetC70_1: C70.1 C74.1 J7.2 Q8.3(Vdd)
NetC71_1: C71.1 R23.1 R24.2
NetC75_1: C75.1 C77.1 Q8.2(Vgg) R46.2
NetC76_2: C76.2 R26.1 R32.2 R37.2
NetC78_2: C78.2 C83.2 D37.2(A) FB2.2 R51.2 U20.2(OUT) U20.4(VOUT)
NetC79_2: C79.2 C82.2 Q10.3(D) U20.3(IN)
NetC84_1: C84.1 C96.1 K26.5 K26.8
NetC85_1: C85.1 C97.1 K28.5 K28.8
NetC86_1: C86.1 C98.1 K30.5 K30.8
NetC87_1: C87.1 C99.1 K32.5 K32.8
NetC88_1: C88.1 C100.1 K34.5 K34.8
NetC89_1: C89.1 D49.1 R65.2
NetC90_2: C90.2 D50.1 R67.2
NetC112_1: C112.1 K50.4
NetC112_2: C112.2 Q4.1(IN)
NetC113_1: C113.1 D1.1 R49.2
NetC117_2: C117.2 D3.1 R50.2
NetC120_1: C120.1 K50.5
NetC120_2: C120.2 L46.1 Q4.3(OUT)
NetC121_2: C121.2 C122.2 C127.2 C133.1 D51.1 K50.1 R39.2 U6.4(OUT)
NetC129_2: C129.2 C130.2 Q11.3(D) U6.3(IN)
NetC201_1: C201.1 C204.2 K4.5 L140.1
NetC201_2: C201.2 C202.1 C207.2 L140.2 L141.1
NetC202_2: C202.2 C203.1 C208.2 L141.2 L142.1
NetC203_2: C203.2 C210.1 K4.8 L142.2
NetC305_1: C305.1 L301.2 U24.4(RF1)
NetC305_2: C305.2 C306.1 L302.2
NetC306_2: C306.2 L303.2 U25.4(RF1)
NetC307_2: C307.2 C311.2 C314.2 L305.2 L308.1
NetC308_1: C308.1 C316.2 L149.1 U24.7(RF3)
NetC308_2: C308.2 C310.1 C317.2 L149.2 L151.1
NetC310_2: C310.2 C319.2 C386.1 C388.2 L134.2 L151.2
NetC311_1: C311.1 L307.2
NetC312_1: C312.1 L308.2
NetC312_2: C312.2 C315.2 L306.2 U25.14(RF4)
NetC313_2: C313.2 L304.2 L307.1 U24.14(RF4)
NetC316_1: C316.1 L152.2
NetC317_1: C317.1 L153.2
NetC319_1: C319.1 L155.2
NetC320_1: C320.1 L312.2
NetC320_2: C320.2 C323.2 L310.2 L313.1
NetC321_1: C321.1 L313.2
NetC321_2: C321.2 C324.2 L311.2 U25.17(RF2)
NetC322_2: C322.2 L309.2 L312.1 U24.17(RF2)
NetC332_1: C332.1 L317.2
NetC332_2: C332.2 C335.2 L315.2 L318.1
NetC333_1: C333.1 L318.2
NetC333_2: C333.2 C336.2 L316.2 U27.7(RF3)
NetC334_2: C334.2 L314.2 L317.1 U26.7(RF3)
NetC344_1: C344.1 L322.2
NetC344_2: C344.2 C347.2 L320.2 L323.1
NetC345_1: C345.1 L323.2
NetC345_2: C345.2 C348.2 L321.2 U27.4(RF1)
NetC346_2: C346.2 L319.2 L322.1 U26.4(RF1)
NetC358_1: C358.1 L327.2
NetC358_2: C358.2 C361.2 L325.2 L328.1
NetC359_1: C359.1 L328.2
NetC359_2: C359.2 C362.2 L326.2 U27.14(RF4)
NetC360_2: C360.2 L324.2 L327.1 U26.14(RF4)
NetC372_1: C372.1 L332.2
NetC372_2: C372.2 C375.2 L330.2 L333.1
NetC373_1: C373.1 L333.2
NetC373_2: C373.2 C376.2 L331.2 U27.17(RF2)
NetC374_2: C374.2 L329.2 L332.1 U26.17(RF2)
NetC386_2: C386.2 C387.1 C389.2 L135.2
NetC387_2: C387.2 C390.2 L136.2 U25.7(RF3)
NetD1_2: D1.2 R56.1 TSWR.1
NetD3_2: D3.2 R55.2 TSWR.2 TSWR.6
NetD37_1: D37.1(K) FB1.1 R32.1
NetD49_2: D49.2 T6.3(FRWD)
NetD50_2: D50.2 T6.4(REF)
NetFB2_1: FB2.1 R46.3
NetJ1_5: J1.5 K1.3 K1.10
NetJ3_3: J3.3 R3.2
NetJ3_4: J3.4 R7.1
NetJ3_5: J3.5 R8.2
NetJ3_6: J3.6 R9.1
NetJ3_7: J3.7 R10.2
NetJ3_8: J3.8 R11.1
NetJ3_9: J3.9(ALC_IN) R12.2
NetJ5_5: J5.5 K1.5 K1.8
NetJ9_5: J9.5 U4.3 U4.6
NetK4_3: K4.3 K4.10
NetK8_3: K8.3 K8.10
NetK9_3: K9.3 K9.10
NetK10_3: K10.3 K10.10
NetK11_3: K11.3 K11.10
NetK12_3: K12.3 K12.10
NetK13_3: K13.3 K13.10
NetK14_3: K14.3 K14.10
NetK15_3: K15.3 K15.10
NetK16_3: K16.3 K16.10
NetK17_3: K17.3 K17.10
NetK18_3: K18.3 K18.10
NetK19_3: K19.3 K19.10
NetK20_3: K20.3 K20.10
NetK21_3: K21.3 K21.10
NetK25_3: K25.3 K25.10 K27.4 K27.9 L35.2 L36.1
NetK26_4: K26.4 K26.9 K28.4 K28.9 K30.4 K30.9 K32.4 K32.9 K34.4 K34.9 K35.4 K35.9
NetK27_3: K27.3 K27.10 K29.4 K29.9 L36.2 L39.1
NetK29_3: K29.3 K29.10 K31.4 K31.9 L39.2 L41.1
NetK31_3: K31.3 K31.10 K33.4 K33.9 L41.2 L42.1
NetK50_2: K50.2 K50.7
NetL1_1: L1.1 Q8.4(Pout)
NetL46_2: L46.2 R39.1
NetQ11_1: Q11.1(G) Q12.3(D) R48.1
NetR51_1: R51.1 R58.1 U20.1(ADJ/GND)
NetR66_2: R66.2 T6.5(ADJ)
NetU1_2: U1.2(SERIN) U7.9(SEROUT)
NetU1_9: U1.9(SEROUT) U11.2(SERIN)
NetU2_2: U2.2(SERIN) U3.9(SEROUT)
NetU3_2: U3.2(SERIN) U11.9(SEROUT)
NetU7_2: U7.2(SERIN) U21.9(SEROUT)
NetU13_5: U13.5(RF2) U14.5(RF2)
NetU13_8: U13.8(RF1) U25.10(RFC) U27.10(RFC)
NetU14_8: U14.8(RF1) U24.10(RFC) U26.10(RFC)
(unnamed): sheet U_HF_AMP_DRIVER/HF_AMP_DRIVER_OUT_A, sheet U_HF_AMP/HF_AMP_DRIVER_OUT_A
(unnamed): sheet U_HF_AMP_DRIVER/HF_AMP_DRIVER_OUT_B, sheet U_HF_AMP/HF_AMP_DRIVER_OUT_B

Not connected (* = marked no-connect by the designer): K25 5 8; K26 3 10; K27 5 8; K28 3 10; K29 5 8; K30 3 10; K31 5 8; K32 3 10; K33 5 8; K34 3 10; L? 1 2; Q8 5(GND); R66 1; U2 9(SEROUT); U3 11(DRAIN4)* 12(DRAIN5)* 13(DRAIN6)* 14(DRAIN7)*

## Layout directives
net class HF_NET: (no net found under the mark), ANT OUT, GND, HF AMP_IN, HF SWR_OUT, HF TUNER_OUT, NetC84_1, NetC85_1, NetC86_1, NetC87_1, NetC88_1, NetK26_4, TX LNA BYPASS, VHF AMP_IN, VHF BPF_OUT, VHF SWR_OUT

## Notes on the sheet
- CONNECTIONS
- LNA
- (near L31) Need to cut the connection between C69 and L31 on the PCB
- VHF RF AMP
- (near L?) 3,5turns on 6mm
  no footprint on the PCB
- (near L?) LPF - 145 MHz
- (near L2) 3,5turns on 6mm
- (near C?) no footprint on the PCB
- (near T6) VHF SWR Meter
- ATT+LPF
- (near TSWR) HF SWR Tandem Match
- HF RF AMP
- CONTROL
- HF TUNER
- LPF
- BPF
- 60 MHz
- 4.5 turns on 6mm
- 144 MHz
- 31 MHz
- T68-2 - 6 turns
- HPF 60+MHz
- +12
- 22 MHz
- T68-2 - 8 turns
- 21-60MHz
- 2.2uH - T68-2 - 20 turns
  1uH - T68-2 - 13 turns
  450nH - T68-2 - 9 turns
  220nH - T68-2 - 6 turns
  100nH - T68-2 - 4 turns
- 15 MHz
- L16 - T68-2 - 11 turns
  L17 - T68-2 - 10 turns
- 11-25MHz
- 7.5 MHz
- T68-2 - 14 turns
- 6.5-15MHz
- 4.5 MHz
- (near L23) T68-2 - 20 turns
- 4.2-9MHz
- 2.5 MHz
- (near L26) T68-2 - 28 turns
- 2.3-5.2MHz
- 1.4-2.8MHz
- File:
- Created:
- Checked
- Released:
- Date
- Name
- Size:
- Sheet
- Revision:
- A3
- of
- (in symbol G6K-2F-5V) +

## Library data of the parts
C1 C7-C11 C16 C67 C71 C76 C78 C82 C89 C90 C107-C110 C113 C117 C123 C124 C130 C131 C133 C141-C154 C157-C167 C170 C171 C241 C301-C304 = 100n: nameAlias: Value(F); Contributor: LCEDA_Lib; spicePre: C; spiceSymbolName: C_0805_EU
C2 C3 = 2pF: nameAlias: Value(F); Contributor: LCEDA_Lib; spicePre: C; spiceSymbolName: C_1206_EU
C4-C6 C? = 5pF: nameAlias: Value(F); Contributor: LCEDA_Lib; spicePre: C; spiceSymbolName: C_1206_EU
C12 C15 = 15+10pF: nameAlias: Value(F); Contributor: LCEDA_Lib; spicePre: C; spiceSymbolName: C_1206_EU
C13 = 10+10pF: nameAlias: Value(F); Contributor: LCEDA_Lib; spicePre: C; spiceSymbolName: C_1206_EU
C14 C17 C19 C20 C72 C87 C314 C322 C389 = 100pF: nameAlias: Value(F); Contributor: LCEDA_Lib; spicePre: C
  C14 C17 C19 C20 C87: spiceSymbolName: C_1206_EU
  C72 C314 C322 C389: spiceSymbolName: C_0805_EU
C18 = 100+22pF: nameAlias: Value(F); Contributor: LCEDA_Lib; spicePre: C; spiceSymbolName: C_1206_EU
C21 C26 C31 C36 C38 C42 C47-C56 = CAP_0805: Value: 100n
C22 C25 C28 C320 = 150pF: nameAlias: Value(F); Contributor: LCEDA_Lib; spicePre: C
  C22 C25 C28: spiceSymbolName: C_1206_EU
  C320: spiceSymbolName: C_0805_EU
C23 C86 C305 C313 = 47pF: nameAlias: Value(F); Contributor: LCEDA_Lib; spicePre: C
  C23 C86: spiceSymbolName: C_1206_EU
  C305 C313: spiceSymbolName: C_0805_EU
C24 C27 C30 C88 = 220pF: nameAlias: Value(F); Contributor: LCEDA_Lib; spicePre: C; spiceSymbolName: C_1206_EU
C29 C323 C344 C346 = 330pF: nameAlias: Value(F); Contributor: LCEDA_Lib; spicePre: C
  C29: spiceSymbolName: C_1206_EU
  C323 C344 C346: spiceSymbolName: C_0805_EU
C32-C35 C336 C360 = 470pF: nameAlias: Value(F); Contributor: LCEDA_Lib; spicePre: C
  C32-C35: spiceSymbolName: C_1206_EU
  C336 C360: spiceSymbolName: C_0805_EU
C37 C41 = 470+330pF: nameAlias: Value(F); Contributor: LCEDA_Lib; spicePre: C; spiceSymbolName: C_1206_EU
C39 C45 = 1000pF: nameAlias: Value(F); Contributor: LCEDA_Lib; spicePre: C; spiceSymbolName: C_1206_EU
C40 C335 = 560pF: nameAlias: Value(F); Contributor: LCEDA_Lib; spicePre: C
  C40: spiceSymbolName: C_1206_EU
  C335: spiceSymbolName: C_0805_EU
C43 C46 = 1000+220pF: nameAlias: Value(F); Contributor: LCEDA_Lib; spicePre: C; spiceSymbolName: C_1206_EU
C44 = 1000+470pF: nameAlias: Value(F); Contributor: LCEDA_Lib; spicePre: C; spiceSymbolName: C_1206_EU
C65 C66 C386 C387 = 6.5-30pF: BOM_Manufacturer: Murata Electronics; BOM_Manufacturer Part: TZC3P300A110R00; nameAlias: Value; Contributor: LCSC; BOM_Supplier: LCSC; BOM_Supplier Part: C107707; spicePre: C; spiceSymbolName: TZC3P300A110R00
C68 C73 C315 C321 C388 C390 = 120pF: nameAlias: Value(F); Contributor: LCEDA_Lib; spicePre: C; spiceSymbolName: C_0805_EU
C69 C121 = 10n: nameAlias: Value(F); Contributor: LCEDA_Lib; spicePre: C; spiceSymbolName: C_0805_EU
C70 C75 = 4.7n: nameAlias: Value(F); Contributor: LCEDA_Lib; spicePre: C; spiceSymbolName: C_0805_EU
C74 C77 = 22uF: nameAlias: Value(F); Contributor: EasyEDA; spicePre: C; spiceSymbolName: Cap_Tantalum(SMD)_B-3528_EU
C79 C83 = 1uF: nameAlias: Value(F); Contributor: LCEDA_Lib; spicePre: C; spiceSymbolName: C_0805_EU
C84 = 10pF: nameAlias: Value(F); Contributor: LCEDA_Lib; spicePre: C; spiceSymbolName: C_1206_EU
C85 = 22pF: nameAlias: Value(F); Contributor: LCEDA_Lib; spicePre: C; spiceSymbolName: C_1206_EU
C96-C100 = *: BOM_Manufacturer: TDK; BOM_Manufacturer Part: CC45SL3AD101JYSNA; Contributor: LCSC; BOM_Supplier: LCSC; BOM_Supplier Part: C2835349; spicePre: C; spiceSymbolName: CC45SL3AD101JYSNA
C112 C120 C122 C347 C348 C372 = 1n: nameAlias: Value(F); Contributor: LCEDA_Lib; spicePre: C; spiceSymbolName: C_0805_EU
C127 C132 = 100p: nameAlias: Value(F); Contributor: LCEDA_Lib; spicePre: C; spiceSymbolName: C_0805_EU
C129 = C1206: CAP, CERM, +/- 10%, X7R, 1206; Tolerance_%: 10; TaMin_C: -55; TaMax_C: 125; SizeArea_mm2: 5.12; SizeAreaWB_mm2: 10.92; SizeX_mm: 3.2; SizeY_mm: 1.6; SizeZ_mm: 1.8; Value1: 100V; PackageReference: 1206; MountType: SMT; Technology: Ceramic; TempCo: X7R
C201 = 39p: nameAlias: Value(F); Contributor: LCEDA_Lib; spicePre: C; spiceSymbolName: C_0805_EU
C202 C208 = 68p: nameAlias: Value(F); Contributor: LCEDA_Lib; spicePre: C; spiceSymbolName: C_0805_EU
C203 = 12p: nameAlias: Value(F); Contributor: LCEDA_Lib; spicePre: C; spiceSymbolName: C_0805_EU
C204 = 27p: nameAlias: Value(F); Contributor: LCEDA_Lib; spicePre: C; spiceSymbolName: C_0805_EU
C207 = 51p: nameAlias: Value(F); Contributor: LCEDA_Lib; spicePre: C; spiceSymbolName: C_0805_EU
C210 = 47p: nameAlias: Value(F); Contributor: LCEDA_Lib; spicePre: C; spiceSymbolName: C_0805_EU
C306 = 33pF: nameAlias: Value(F); Contributor: LCEDA_Lib; spicePre: C; spiceSymbolName: C_0805_EU
C307 = 39pF: nameAlias: Value(F); Contributor: LCEDA_Lib; spicePre: C; spiceSymbolName: C_0805_EU
C308 C310 = 110pF: nameAlias: Value(F); Contributor: LCEDA_Lib; spicePre: C; spiceSymbolName: C_0805_EU
C311 = 75pF: nameAlias: Value(F); Contributor: LCEDA_Lib; spicePre: C; spiceSymbolName: C_0805_EU
C312 = 61pF: nameAlias: Value(F); Contributor: LCEDA_Lib; spicePre: C; spiceSymbolName: C_0805_EU
C316 C319 = 8pF: nameAlias: Value(F); Contributor: LCEDA_Lib; spicePre: C; spiceSymbolName: C_0805_EU
C317 = 15pF: nameAlias: Value(F); Contributor: LCEDA_Lib; spicePre: C; spiceSymbolName: C_0805_EU
C324 C332 C345 = 270pF: nameAlias: Value(F); Contributor: LCEDA_Lib; spicePre: C; spiceSymbolName: C_0805_EU
C333 C334 = 180pF: nameAlias: Value(F); Contributor: LCEDA_Lib; spicePre: C; spiceSymbolName: C_0805_EU
C358 C373 = 820pF: nameAlias: Value(F); Contributor: LCEDA_Lib; spicePre: C; spiceSymbolName: C_0805_EU
C359 = 680pF: nameAlias: Value(F); Contributor: LCEDA_Lib; spicePre: C; spiceSymbolName: C_0805_EU
C361 = 1.5n: nameAlias: Value(F); Contributor: LCEDA_Lib; spicePre: C; spiceSymbolName: C_0805_EU
C362 C374 = 1.2n: nameAlias: Value(F); Contributor: LCEDA_Lib; spicePre: C; spiceSymbolName: C_0805_EU
C375 C376 = 3.3n: nameAlias: Value(F); Contributor: LCEDA_Lib; spicePre: C; spiceSymbolName: C_0805_EU
D1 D3 D49 D50 = BAT46JFILM: BOM_Manufacturer: STMicroelectronics; Contributor: LCSC; BOM_Supplier: LCSC; BOM_Supplier Part: C111205; BOM_Manufacturer Part: BAT46JFILM; BOM_JLCPCB Part Class: Extended Part; spicePre: D; spiceSymbolName: BAT46JFILM
D2 = SMAJ5.0A-TR: BOM_Manufacturer: STMicroelectronics; Contributor: LCSC; BOM_Supplier: LCSC; BOM_Supplier Part: C98802; BOM_Manufacturer Part: SMAJ5.0A-TR; BOM_JLCPCB Part Class: Extended Part; spicePre: D; spiceSymbolName: SMAJ5.0A-TR
D4 D5 D8 D9 D13 D15 D17 D20 D22 D25 D27 D31 D32 D38-D48 D51 = 1N4148W: BOM_Manufacturer: Tak Cheong; Contributor: LCEDA_Lib; BOM_Supplier: LCSC; BOM_Manufacturer Part: 1N4148W; BOM_Supplier Part: C129216; spicePre: D; spiceSymbolName: 1N4148W
D7 = BAV99: BOM_Manufacturer: DIODES; BOM_Manufacturer Part: BAV99-7-F; BOM_Supplier: LCSC; BOM_Supplier Part: C106919; BOM_JLCPCB Part Class: Extended Part; spicePre: D; spiceSymbolName: BAV99-7-F
D37 = SS14: BOM_Manufacturer: MDD; BOM_Supplier: LCSC; BOM_Manufacturer Part: SS14; BOM_Supplier Part: C2480; BOM_JLCPCB Part Class: Basic Part; spicePre: D; spiceSymbolName: SS14
FB1 FB2 = BLM21: Contributor: Tommy H; spicePre: L; spiceSymbolName: IND_FERRITE_BEAD
H1 = FAN_OUT: Contributor: LCEDA_Lib; BOM_Supplier Part: C49661; BOM_Supplier: LCSC; spicePre: H; spiceSymbolName: HDR-F-2.54_1x2
J1 = ANT1: BOM_Manufacturer: DreamLNK; BOM_Manufacturer Part: SMA-KE-P901; Contributor: LCSC; BOM_Supplier: LCSC; BOM_Supplier Part: C914556; BOM_JLCPCB Part Class: Extended Part; spicePre: R; spiceSymbolName: SMA-KE-P901
J2 = ADC: BOM_Manufacturer: DreamLNK; BOM_Manufacturer Part: SMA-KE-P901; Contributor: LCSC; BOM_Supplier: LCSC; BOM_Supplier Part: C914556; BOM_JLCPCB Part Class: Extended Part; spicePre: R; spiceSymbolName: SMA-KE-P901
J5 = ANT2: BOM_Manufacturer: DreamLNK; BOM_Manufacturer Part: SMA-KE-P901; Contributor: LCSC; BOM_Supplier: LCSC; BOM_Supplier Part: C914556; BOM_JLCPCB Part Class: Extended Part; spicePre: R; spiceSymbolName: SMA-KE-P901
J7 = HiCurrent13.8V: BOM_Manufacturer: Toponelec(拓宜); BOM_Manufacturer Part: TY500-5.08-02P-14-00AH; Contributor: LCSC; BOM_Supplier: LCSC; BOM_Supplier Part: C2828268; BOM_JLCPCB Part Class: Extended Part; spicePre: C; spiceSymbolName: TY500-5.08-02P-14-00AH
J9 = DAC: BOM_Manufacturer: DreamLNK; BOM_Manufacturer Part: SMA-KE-P901; Contributor: LCSC; Package Display: No; BOM_Supplier: LCSC; BOM_Supplier Part: C914556; BOM_JLCPCB Part Class: Extended Part; spicePre: R; spiceSymbolName: SMA-KE-P901
K1 K2 K4 K8-K21 K24-K35 = G6S-2-12V: BOM_Manufacturer: OMRON; BOM_Supplier: LCSC; BOM_Manufacturer Part: G6S-2-12V; BOM_Supplier Part: C28410; BOM_JLCPCB Part Class: Extended Part; spicePre: K; spiceSymbolName: G6S-2-12V
K50 = G6K-2F-5V: BOM_Manufacturer: Omron Electronics; Contributor: LCSC; BOM_Supplier: LCSC; BOM_Supplier Part: C231389; BOM_Manufacturer Part: -; spicePre: K; spiceSymbolName: G6K-2F-Y DC5
L1-L3 L? = 0.2uH: BOM_Manufacturer: China; BOM_Manufacturer Part: BL02RN2R1M2; nameAlias: Value(H); Value: 7A; Contributor: Константин Сергеевич; BOM_Supplier Part: C84974; spicePre: L; spiceSymbolName: T68-2 Iron Powder Toroidal Inductor
L7 L8 = 0.065uH: BOM_Manufacturer: China; BOM_Manufacturer Part: BL02RN2R1M2; nameAlias: Value(H); Value: 7A; Contributor: Константин Сергеевич; BOM_Supplier Part: C84974; spicePre: L; spiceSymbolName: T68-2 Iron Powder Toroidal Inductor
L10 L11 = 0.15uH: BOM_Manufacturer: China; BOM_Manufacturer Part: BL02RN2R1M2; nameAlias: Value(H); Value: 7A; Contributor: Константин Сергеевич; BOM_Supplier Part: C84974; spicePre: L; spiceSymbolName: T68-2 Iron Powder Toroidal Inductor
L13 L14 = 0.3uH: BOM_Manufacturer: China; BOM_Manufacturer Part: BL02RN2R1M2; nameAlias: Value(H); Value: 7A; Contributor: Константин Сергеевич; BOM_Supplier Part: C84974; spicePre: L; spiceSymbolName: T68-2 Iron Powder Toroidal Inductor
L16 L17 = 0.6uH: BOM_Manufacturer: China; BOM_Manufacturer Part: BL02RN2R1M2; nameAlias: Value(H); Value: 7A; Contributor: Константин Сергеевич; BOM_Supplier Part: C84974; spicePre: L; spiceSymbolName: T68-2 Iron Powder Toroidal Inductor
L19 L20 = 1.15uH: BOM_Manufacturer: China; BOM_Manufacturer Part: BL02RN2R1M2; nameAlias: Value(H); Value: 7A; Contributor: Константин Сергеевич; BOM_Supplier Part: C84974; spicePre: L; spiceSymbolName: T68-2 Iron Powder Toroidal Inductor
L22 L23 = 2.3uH: BOM_Manufacturer: China; BOM_Manufacturer Part: BL02RN2R1M2; nameAlias: Value(H); Value: 7A; Contributor: Константин Сергеевич; BOM_Supplier Part: C84974; spicePre: L; spiceSymbolName: T68-2 Iron Powder Toroidal Inductor
L25 L26 = 4.5uH: BOM_Manufacturer: China; BOM_Manufacturer Part: BL02RN2R1M2; nameAlias: Value(H); Value: 7A; Contributor: Константин Сергеевич; BOM_Supplier Part: C84974; spicePre: L; spiceSymbolName: T68-2 Iron Powder Toroidal Inductor
L31 L46 = 0.22u: nameAlias: Value(H); Contributor: LCEDA_Lib; spicePre: L; spiceSymbolName: L0805_US
L32-L34 = 0.0082u: nameAlias: Value(H); Contributor: LCEDA_Lib; spicePre: L; spiceSymbolName: L0805_US
L35 = 0.1uH: BOM_Manufacturer: China; BOM_Manufacturer Part: BL02RN2R1M2; nameAlias: Value(H); Value: 7A; Contributor: Константин Сергеевич; BOM_Supplier Part: C84974; spicePre: L; spiceSymbolName: T68-2 Iron Powder Toroidal Inductor
L36 = 0.22uH: BOM_Manufacturer: China; BOM_Manufacturer Part: BL02RN2R1M2; nameAlias: Value(H); Value: 7A; Contributor: Константин Сергеевич; BOM_Supplier Part: C84974; spicePre: L; spiceSymbolName: T68-2 Iron Powder Toroidal Inductor
L39 = 0.45uH: BOM_Manufacturer: China; BOM_Manufacturer Part: BL02RN2R1M2; nameAlias: Value(H); Value: 7A; Contributor: Константин Сергеевич; BOM_Supplier Part: C84974; spicePre: L; spiceSymbolName: T68-2 Iron Powder Toroidal Inductor
L41 = 1.0uH: BOM_Manufacturer: China; BOM_Manufacturer Part: BL02RN2R1M2; nameAlias: Value(H); Value: 7A; Contributor: Константин Сергеевич; BOM_Supplier Part: C84974; spicePre: L; spiceSymbolName: T68-2 Iron Powder Toroidal Inductor
L42 = 2.2uH: BOM_Manufacturer: China; BOM_Manufacturer Part: BL02RN2R1M2; nameAlias: Value(H); Value: 7A; Contributor: Константин Сергеевич; BOM_Supplier Part: C84974; spicePre: L; spiceSymbolName: T68-2 Iron Powder Toroidal Inductor
L134-L136 = 0.0082u: BOM_Manufacturer: KEMET; BOM_Manufacturer Part: L0805C100MDWIT; Contributor: Константин Тищенко; BOM_Supplier: LCSC; BOM_Supplier Part: C696787; spicePre: L; spiceSymbolName: L0805-WOLF
L140 = 0.1u: nameAlias: Value(H); Contributor: LCEDA_Lib; spicePre: L; spiceSymbolName: L0805_US
L141 = 0.082u: nameAlias: Value(H); Contributor: LCEDA_Lib; spicePre: L; spiceSymbolName: L0805_US
L142 = 0.15u: nameAlias: Value(H); Contributor: LCEDA_Lib; spicePre: L; spiceSymbolName: L0805_US
L149 L151 = 0.022u: BOM_Manufacturer: KEMET; BOM_Manufacturer Part: L0805C100MDWIT; Contributor: Константин Тищенко; BOM_Supplier: LCSC; BOM_Supplier Part: C696787; spicePre: L; spiceSymbolName: L0805-WOLF
L152 L155 L308 L310 L311 = 0.33u: BOM_Manufacturer: KEMET; BOM_Manufacturer Part: L0805C100MDWIT; Contributor: Константин Тищенко; BOM_Supplier: LCSC; BOM_Supplier Part: C696787; spicePre: L; spiceSymbolName: L0805-WOLF
L153 = 0.18u: BOM_Manufacturer: KEMET; BOM_Manufacturer Part: L0805C100MDWIT; Contributor: Константин Тищенко; BOM_Supplier: LCSC; BOM_Supplier Part: C696787; spicePre: L; spiceSymbolName: L0805-WOLF
L301 L307 = 0.27u: BOM_Manufacturer: KEMET; BOM_Manufacturer Part: L0805C100MDWIT; Contributor: Константин Тищенко; BOM_Supplier: LCSC; BOM_Supplier Part: C696787; spicePre: L; spiceSymbolName: L0805-WOLF
L302 = 0.082u: BOM_Manufacturer: KEMET; BOM_Manufacturer Part: L0805C100MDWIT; Contributor: Константин Тищенко; BOM_Supplier: LCSC; BOM_Supplier Part: C696787; spicePre: L; spiceSymbolName: L0805-WOLF
L303 = 0.1u: BOM_Manufacturer: KEMET; BOM_Manufacturer Part: L0805C100MDWIT; Contributor: Константин Тищенко; BOM_Supplier: LCSC; BOM_Supplier Part: C696787; spicePre: L; spiceSymbolName: L0805-WOLF
L304 L315 = 0.47u: BOM_Manufacturer: KEMET; BOM_Manufacturer Part: L0805C100MDWIT; Contributor: Константин Тищенко; BOM_Supplier: LCSC; BOM_Supplier Part: C696787; spicePre: L; spiceSymbolName: L0805-WOLF
L305 L306 = 0.15u: BOM_Manufacturer: KEMET; BOM_Manufacturer Part: L0805C100MDWIT; Contributor: Константин Тищенко; BOM_Supplier: LCSC; BOM_Supplier Part: C696787; spicePre: L; spiceSymbolName: L0805-WOLF
L309 L317 = 1u: BOM_Manufacturer: KEMET; BOM_Manufacturer Part: L0805C100MDWIT; Contributor: Константин Тищенко; BOM_Supplier: LCSC; BOM_Supplier Part: C696787; spicePre: L; spiceSymbolName: L0805-WOLF
L312 L316 = 0.56u: BOM_Manufacturer: KEMET; BOM_Manufacturer Part: L0805C100MDWIT; Contributor: Константин Тищенко; BOM_Supplier: LCSC; BOM_Supplier Part: C696787; spicePre: L; spiceSymbolName: L0805-WOLF
L313 L321 = 0.82u: BOM_Manufacturer: KEMET; BOM_Manufacturer Part: L0805C100MDWIT; Contributor: Константин Тищенко; BOM_Supplier: LCSC; BOM_Supplier Part: C696787; spicePre: L; spiceSymbolName: L0805-WOLF
L314 L318 L325 = 1.5u: BOM_Manufacturer: KEMET; BOM_Manufacturer Part: L0805C100MDWIT; Contributor: Константин Тищенко; BOM_Supplier: LCSC; BOM_Supplier Part: C696787; spicePre: L; spiceSymbolName: L0805-WOLF
L319 L326 = 1.8u: BOM_Manufacturer: KEMET; BOM_Manufacturer Part: L0805C100MDWIT; Contributor: Константин Тищенко; BOM_Supplier: LCSC; BOM_Supplier Part: C696787; spicePre: L; spiceSymbolName: L0805-WOLF
L320 = 0.68u: BOM_Manufacturer: KEMET; BOM_Manufacturer Part: L0805C100MDWIT; Contributor: Константин Тищенко; BOM_Supplier: LCSC; BOM_Supplier Part: C696787; spicePre: L; spiceSymbolName: L0805-WOLF
L322 L330 L331 = 2.2u: BOM_Manufacturer: KEMET; BOM_Manufacturer Part: L0805C100MDWIT; Contributor: Константин Тищенко; BOM_Supplier: LCSC; BOM_Supplier Part: C696787; spicePre: L; spiceSymbolName: L0805-WOLF
L323 L327 = 2.7u: BOM_Manufacturer: KEMET; BOM_Manufacturer Part: L0805C100MDWIT; Contributor: Константин Тищенко; BOM_Supplier: LCSC; BOM_Supplier Part: C696787; spicePre: L; spiceSymbolName: L0805-WOLF
L324 = 4.7u: BOM_Manufacturer: KEMET; BOM_Manufacturer Part: L0805C100MDWIT; Contributor: Константин Тищенко; BOM_Supplier: LCSC; BOM_Supplier Part: C696787; spicePre: L; spiceSymbolName: L0805-WOLF
L328 = 3.3u: BOM_Manufacturer: KEMET; BOM_Manufacturer Part: L0805C100MDWIT; Contributor: Константин Тищенко; BOM_Supplier: LCSC; BOM_Supplier Part: C696787; spicePre: L; spiceSymbolName: L0805-WOLF
L329 = 5.6u: BOM_Manufacturer: KEMET; BOM_Manufacturer Part: L0805C100MDWIT; Contributor: Константин Тищенко; BOM_Supplier: LCSC; BOM_Supplier Part: C696787; spicePre: L; spiceSymbolName: L0805-WOLF
L332 = 6.8u: BOM_Manufacturer: KEMET; BOM_Manufacturer Part: L0805C100MDWIT; Contributor: Константин Тищенко; BOM_Supplier: LCSC; BOM_Supplier Part: C696787; spicePre: L; spiceSymbolName: L0805-WOLF
L333 = 8.2u: BOM_Manufacturer: KEMET; BOM_Manufacturer Part: L0805C100MDWIT; Contributor: Константин Тищенко; BOM_Supplier: LCSC; BOM_Supplier Part: C696787; spicePre: L; spiceSymbolName: L0805-WOLF
Q4 = PGA103+/SPF5189Z: Contributor: radiofannat; spicePre: I; spiceSymbolName: SPF5189Z
Q8 = RA80H1415M1: Contributor: konster13.84; BOM_Manufacturer Part: RA80H1415M1; spicePre: U; spiceSymbolName: RA80H1415M1
Q9 = RD01MUS1: Contributor: Broadcastshop; spicePre: U; spiceSymbolName: RD01MUS1
Q10 = IRLML9301: BOM_Manufacturer: VBsemi Elec; BOM_Manufacturer Part: IRLML9301TR; Contributor: LCSC; BOM_Supplier: LCSC; BOM_Supplier Part: C710004; BOM_JLCPCB Part Class: Extended Part; spicePre: Q; spiceSymbolName: IRLML9301TR
Q11 = IRLML9301: BOM_Manufacturer: IR; BOM_Manufacturer Part: IRLML9301TRPBF; Contributor: LCSC; BOM_Supplier: LCSC; BOM_Supplier Part: C82056; BOM_JLCPCB Part Class: Extended Part; spicePre: Q; spiceSymbolName: IRLML9301TRPBF
Q12 = BSS123: BOM_Manufacturer: CJ; BOM_Supplier: LCSC; BOM_Manufacturer Part: BSS123; BOM_Supplier Part: C79015; BOM_JLCPCB Part Class: Extended Part; spicePre: Q; spiceSymbolName: BSS123
R3 R7-R12 = 560: nameAlias: Value(Ω); Contributor: LCEDA_Lib; spicePre: R; spiceSymbolName: R_0805_EU
R13 = 2k: nameAlias: Value(Ω); Contributor: LCEDA_Lib; spicePre: R; spiceSymbolName: R_0805_EU
R14 = KTY81/120: BOM_Manufacturer: NXP(恩智浦); BOM_Manufacturer Part: KTY81/110,112; Contributor: LCSC; BOM_Supplier: LCSC; BOM_Supplier Part: C1527155; spicePre: U; spiceSymbolName: KTY81/110,112
R21 = 750: nameAlias: Value(Ω); Contributor: LCEDA_Lib; spicePre: R; spiceSymbolName: R_0805_EU
R22 = 470: nameAlias: Value(Ω); Contributor: LCEDA_Lib; spicePre: R; spiceSymbolName: R_0805_EU
R23 = 20: nameAlias: Value(Ω); Contributor: LCEDA_Lib; spicePre: R; spiceSymbolName: R_0805_EU
R24 R25 = 300: nameAlias: Value(Ω); Contributor: LCEDA_Lib; spicePre: R; spiceSymbolName: R_0805_EU
R26 = 56: nameAlias: Value(Ω); Contributor: LCEDA_Lib; spicePre: R; spiceSymbolName: R_0805_EU
R31 R33 R35 R57 R69-R72 R201-R207 = 1k: nameAlias: Value(Ω); Contributor: LCEDA_Lib; spicePre: R; spiceSymbolName: R_0805_EU
R32 = 6.8k: nameAlias: Value(Ω); Contributor: LCEDA_Lib; spicePre: R; spiceSymbolName: R_0805_EU
R36 R54 = 510: nameAlias: Value(Ω); Contributor: LCEDA_Lib; spicePre: R; spiceSymbolName: R_1206_EU
R37 = 2.7k: nameAlias: Value(Ω); Contributor: LCEDA_Lib; spicePre: R; spiceSymbolName: R_0805_EU
R39 = 18: nameAlias: Value(Ω); Contributor: LCEDA_Lib; spicePre: R; spiceSymbolName: R_1206_EU
R45 R48 R75 = 30k: nameAlias: Value(Ω); Contributor: LCEDA_Lib; spicePre: R; spiceSymbolName: R_0805_EU
R46 = 1K: BOM_Manufacturer: BOURNS; BOM_Manufacturer Part: 3296W-1-102LF; nameAlias: Resistance (Ohms); BOM_Supplier: LCSC; BOM_Supplier Part: C57089; Resistance(Ohms): 1K; spicePre: R; spiceSymbolName: 3296W-1-102LF
R49 R50 R65 R67 = 0: nameAlias: Value(Ω); Contributor: LCEDA_Lib; spicePre: R; spiceSymbolName: R_1206_EU
R51 = 100: nameAlias: Value(Ω); Contributor: LCEDA_Lib; spicePre: R; spiceSymbolName: R_0805_EU
R55 R56 = 50: nameAlias: Value(Ω); Contributor: LCEDA_Lib; spicePre: R; spiceSymbolName: R_1206_EU
R58 = 620: nameAlias: Value(Ω); Contributor: LCEDA_Lib; spicePre: R; spiceSymbolName: R_0805_EU
R64 R68 = 1K: nameAlias: Value(Ω); Contributor: LCEDA_Lib; spicePre: R; spiceSymbolName: R_1206_EU
R66 = 100: BOM_Manufacturer: ReliaPro; BOM_Manufacturer Part: 3362P-1-105; nameAlias: Resistance(Ohms); BOM_Supplier: LCSC; BOM_Supplier Part: C20063; spicePre: R; spiceSymbolName: 3362P-1-105
R73 = 10k: nameAlias: Value(Ω); Contributor: LCEDA_Lib; spicePre: R; spiceSymbolName: R_1206_EU
T6 = VHF Tandem Meter: Contributor: konster13.84; BOM_Manufacturer Part: VHF Tandem Meter; spicePre: U; spiceSymbolName: VHF Tandem Meter
TSWR = BN-61-202: BOM_Manufacturer Part: 2843010302; BOM_Manufacturer: Fair-Rite; nameAlias: Value(H); Contributor: LCEDA_Lib; BOM_Supplier Part: 2843010302; spicePre: T; spiceSymbolName: BN-43-303_TANDEM
U1-U3 U7 U11 U21 = STPIC6C595TTR: BOM_Manufacturer: STMicroelectronics; Contributor: LCSC; BOM_Supplier: LCSC; BOM_Supplier Part: C222081; BOM_Manufacturer Part: STPIC6C595TTR; BOM_JLCPCB Part Class: Extended Part; spicePre: U; spiceSymbolName: STPIC6C595TTR
U4 = axicom im06c: Contributor: ys1797; BOM_Manufacturer Part: axicom im06c; BOM_Supplier: axicom; spicePre: U; spiceSymbolName: axicom im06c
U9 = PE4302: BOM_Manufacturer: null; BOM_Manufacturer Part: PE4302-EK; Contributor: LCSC; BOM_Supplier: LCSC; BOM_Supplier Part: C2763949; BOM_JLCPCB Part Class: Extended Part; spicePre: U; spiceSymbolName: PE4302-EK
U12 = axicom im06c: Contributor: ys1797; Package Display: No; BOM_Manufacturer Part: axicom im06c; BOM_Supplier: axicom; spicePre: U; spiceSymbolName: axicom im06c
U13 U14 = ADG918BRMZ: BOM_Manufacturer: Analog Devices; BOM_Manufacturer Part: ADG918BRMZ-500RL7; Contributor: LCSC; BOM_Supplier: LCSC; BOM_Supplier Part: C207406; BOM_JLCPCB Part Class: Extended Part; spicePre: U; spiceSymbolName: ADG918BRMZ-500RL7
U20 = LT1117-ADJ: BOM_Manufacturer: Analog Devices; BOM_Manufacturer Part: LT1117IST#PBF; Contributor: LCSC; BOM_Supplier: LCSC; BOM_Supplier Part: C661269; spicePre: U; spiceSymbolName: LT1117IST#PBF
J3 = EXTERNAL: timeStamp: 1471955319; spicePre: C; spiceSymbolName: IDC10
J4 = MOTHERBOARD: timeStamp: 1471955319; spicePre: C; spiceSymbolName: IDC10
U6 = LM1117DT-5.0: spicePre: U; spiceSymbolName: LM1117DT-5.0
U24-U27 = ADG904BRUZ: spicePre: X; spiceSymbolName: ADG904BRUZ